# EAGLE design atlas_quad (EAGLE 8.5.0)

## Sheet 1 of 2
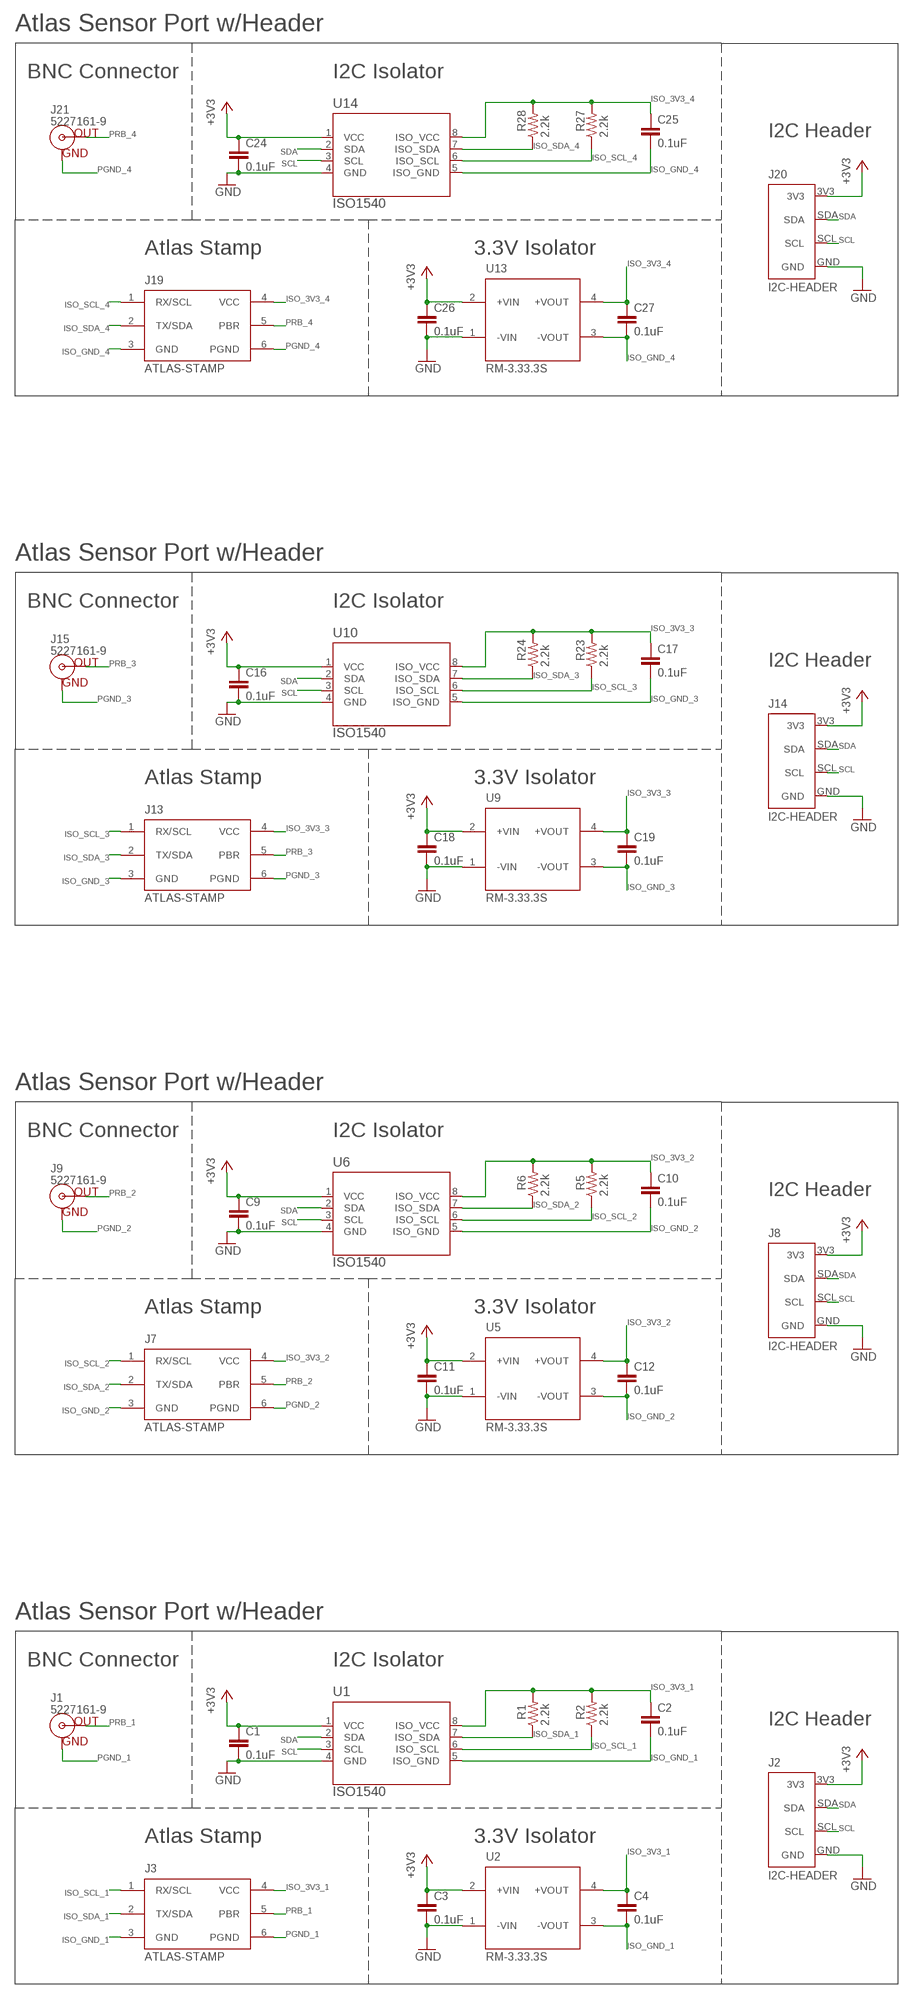
[diagram p0: schematic, sheet 1, part 1 of 3]
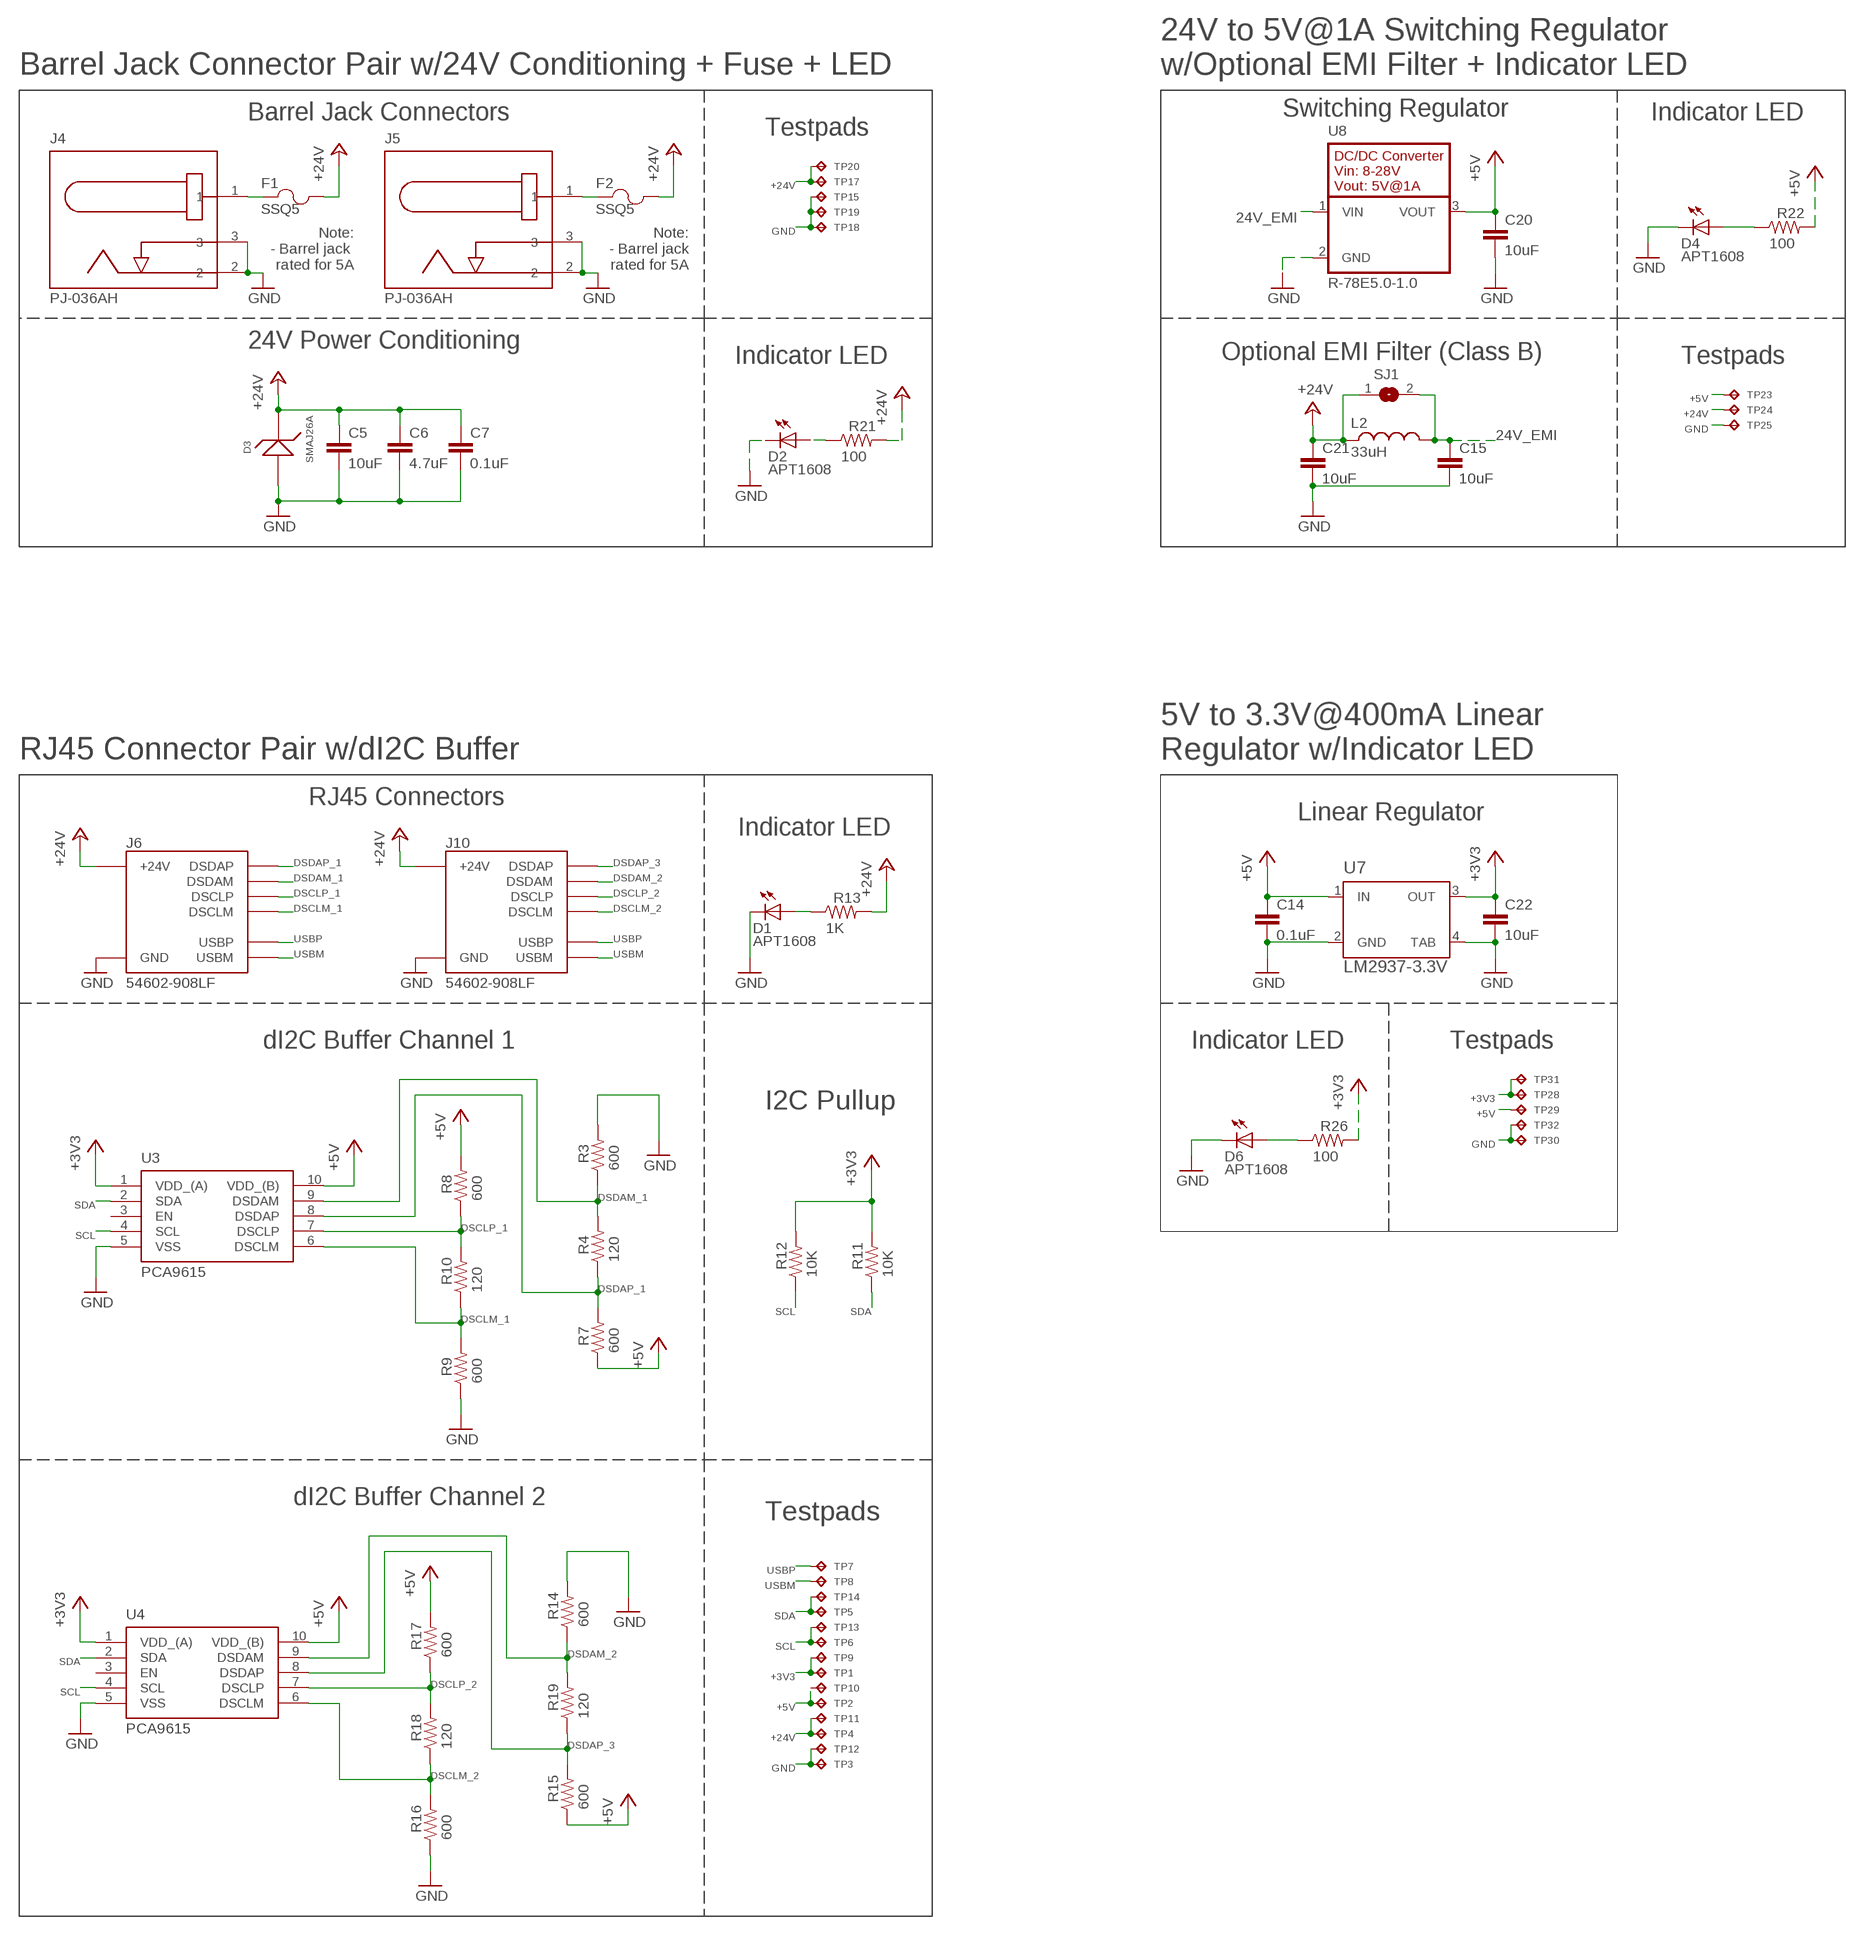
[diagram p1: schematic, sheet 1, part 2 of 3]
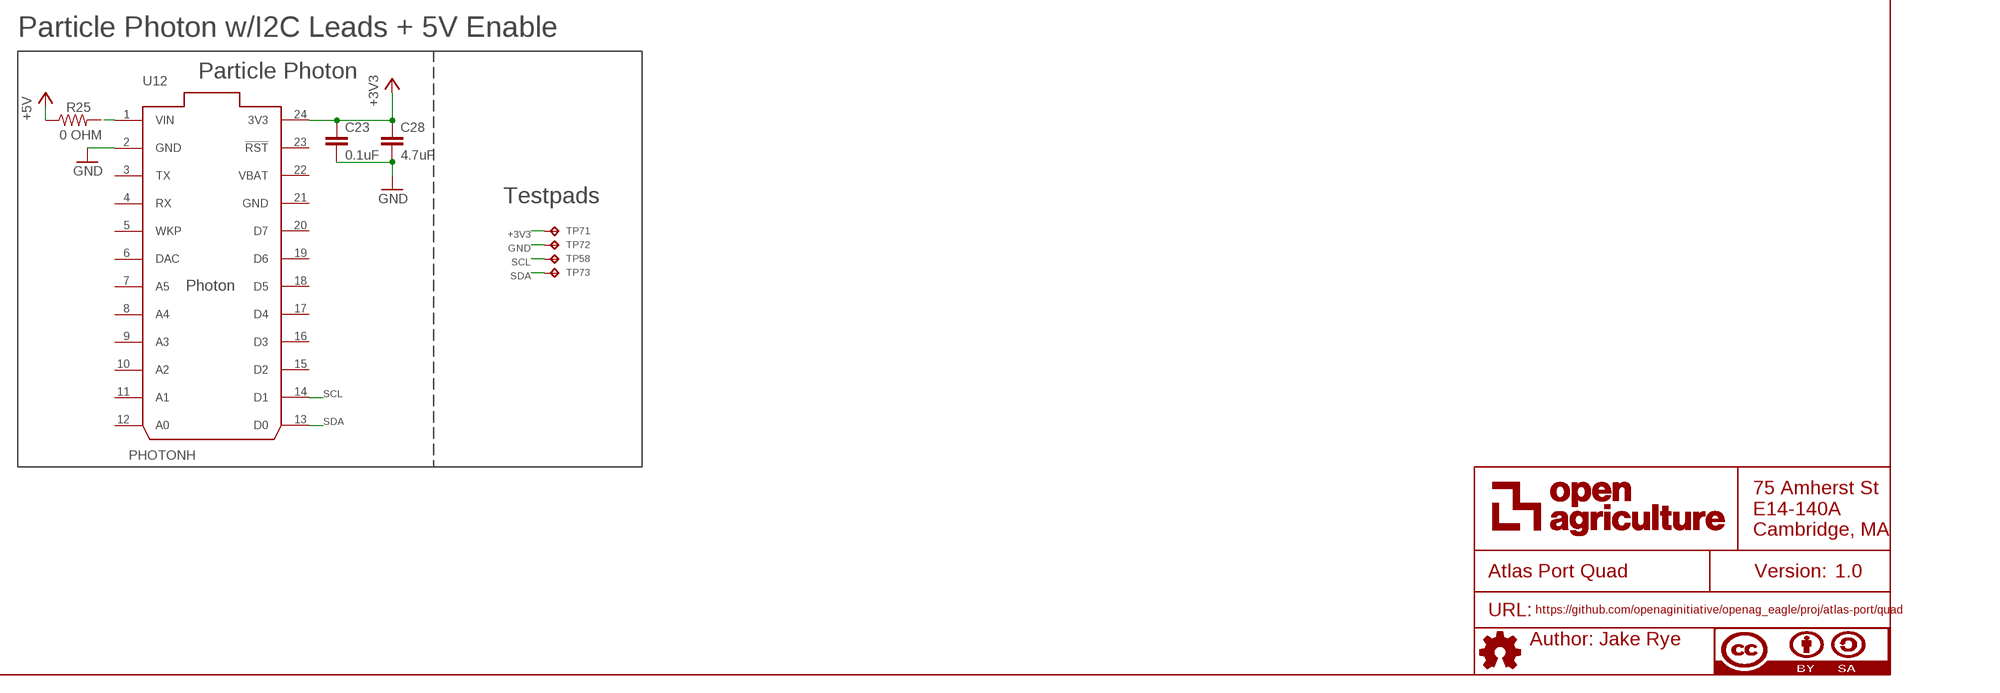
[diagram p2: schematic, sheet 1, part 3 of 3]

### Parts
C1  0.1uF  0.1UF-C0603C104K5RACTU  [C0603]
C2  0.1uF  0.1UF-C0603C104K5RACTU  [C0603]
C3  0.1uF  0.1UF-C0603C104K5RACTU  [C0603]
C4  0.1uF  0.1UF-C0603C104K5RACTU  [C0603]
C5  10uF  10UF-GMK212BBJ106KG-T  [C0805]
C6  4.7uF  4.7UF-CL21A475KBQNNNE  [C0805]
C7  0.1uF  0.1UF-C0603C104K5RACTU  [C0603]
C9  0.1uF  0.1UF-C0603C104K5RACTU  [C0603]
C10  0.1uF  0.1UF-C0603C104K5RACTU  [C0603]
C11  0.1uF  0.1UF-C0603C104K5RACTU  [C0603]
C12  0.1uF  0.1UF-C0603C104K5RACTU  [C0603]
C14  0.1uF  0.1UF-C0603C104K5RACTU  [C0603]
C15  10uF  10UF-GMK212BBJ106KG-T  [C0805]
C16  0.1uF  0.1UF-C0603C104K5RACTU  [C0603]
C17  0.1uF  0.1UF-C0603C104K5RACTU  [C0603]
C18  0.1uF  0.1UF-C0603C104K5RACTU  [C0603]
C19  0.1uF  0.1UF-C0603C104K5RACTU  [C0603]
C20  10uF  10UF-GMK212BBJ106KG-T  [C0805]
C21  10uF  10UF-GMK212BBJ106KG-T  [C0805]
C22  10uF  10UF-GMK212BBJ106KG-T  [C0805]
C23  0.1uF  0.1UF-C0603C104K5RACTU  [C0603]
C24  0.1uF  0.1UF-C0603C104K5RACTU  [C0603]
C25  0.1uF  0.1UF-C0603C104K5RACTU  [C0603]
C26  0.1uF  0.1UF-C0603C104K5RACTU  [C0603]
C27  0.1uF  0.1UF-C0603C104K5RACTU  [C0603]
C28  4.7uF  4.7UF-CL21A475KBQNNNE  [C0805]
D1  APT1608  APT1608CGCK  [CHIPLED_0603]
D2  APT1608  APT1608CGCK  [CHIPLED_0603]
D3  SMAJ26A  SMAJ26A-13-F  [SMA]
D4  APT1608  APT1608CGCK  [CHIPLED_0603]
D6  APT1608  APT1608CGCK  [CHIPLED_0603]
F1  SSQ5  [SS]
F2  SSQ5  [SS]
J1  5227161-9  BNC-5227161-9PTH  [BNC-5227161]
J2  I2C-HEADER  HEADER-I2C  [HEADER-I2C]
J3  ATLAS-STAMP  [ATLAS-STAMP]
J4  PJ-036AH  BARREL-JACK-PJ-036AH-SMT-TR  [BARREL-JACK-PJ-036AH]
J5  PJ-036AH  BARREL-JACK-PJ-036AH-SMT-TR  [BARREL-JACK-PJ-036AH]
J6  54602-908LF  RJ45-DI2C-USB-54602-908LFPTH  [RJ45-DI2C-USB-54602-908LF]
J7  ATLAS-STAMP  [ATLAS-STAMP]
J8  I2C-HEADER  HEADER-I2C  [HEADER-I2C]
J9  5227161-9  BNC-5227161-9PTH  [BNC-5227161]
J10  54602-908LF  RJ45-DI2C-USB-54602-908LFPTH  [RJ45-DI2C-USB-54602-908LF]
J13  ATLAS-STAMP  [ATLAS-STAMP]
J14  I2C-HEADER  HEADER-I2C  [HEADER-I2C]
J15  5227161-9  BNC-5227161-9PTH  [BNC-5227161]
J19  ATLAS-STAMP  [ATLAS-STAMP]
J20  I2C-HEADER  HEADER-I2C  [HEADER-I2C]
J21  5227161-9  BNC-5227161-9PTH  [BNC-5227161]
L2  33uH  33UH-29333C  [29333C]
R1  2.2k  2.2K-RC0603JR-072K2L  [RC0603N]
R2  2.2k  2.2K-RC0603JR-072K2L  [RC0603N]
R3  600  600OHM-RC0603FR-07604RL  [RC0603N]
R4  120  120OHM-RC0603FR-07120RL  [RC0603N]
R5  2.2k  2.2K-RC0603JR-072K2L  [RC0603N]
R6  2.2k  2.2K-RC0603JR-072K2L  [RC0603N]
R7  600  600OHM-RC0603FR-07604RL  [RC0603N]
R8  600  600OHM-RC0603FR-07604RL  [RC0603N]
R9  600  600OHM-RC0603FR-07604RL  [RC0603N]
R10  120  120OHM-RC0603FR-07120RL  [RC0603N]
R11  10K  10K-ERJ-3EKF1002V  [RC0603N]
R12  10K  10K-ERJ-3EKF1002V  [RC0603N]
R13  1K  1K-ERJ-PB3D1001V  [RC0603N]
R14  600  600OHM-RC0603FR-07604RL  [RC0603N]
R15  600  600OHM-RC0603FR-07604RL  [RC0603N]
R16  600  600OHM-RC0603FR-07604RL  [RC0603N]
R17  600  600OHM-RC0603FR-07604RL  [RC0603N]
R18  120  120OHM-RC0603FR-07120RL  [RC0603N]
R19  120  120OHM-RC0603FR-07120RL  [RC0603N]
R21  100  100OHM-RC0603JR-07100RL  [RC0603N]
R22  100  100OHM-RC0603JR-07100RL  [RC0603N]
R23  2.2k  2.2K-RC0603JR-072K2L  [RC0603N]
R24  2.2k  2.2K-RC0603JR-072K2L  [RC0603N]
R25  0 OHM  0OHM-RC0603JR-070RL  [RC0603N]
R26  100  100OHM-RC0603JR-07100RL  [RC0603N]
R27  2.2k  2.2K-RC0603JR-072K2L  [RC0603N]
R28  2.2k  2.2K-RC0603JR-072K2L  [RC0603N]
SJ1  EMI-BYPASS  [EMI-BYPASS]
TP1  TPTP04R  [TP04R]
TP2  TPTP04R  [TP04R]
TP3  TPTP04R  [TP04R]
TP4  TPTP04R  [TP04R]
TP5  TPTP04R  [TP04R]
TP6  TPTP04R  [TP04R]
TP7  TPTP04R  [TP04R]
TP8  TPTP04R  [TP04R]
TP9  TPTP04R  [TP04R]
TP10  TPTP04R  [TP04R]
TP11  TPTP04R  [TP04R]
TP12  TPTP04R  [TP04R]
TP13  TPTP04R  [TP04R]
TP14  TPTP04R  [TP04R]
TP15  TPTP04R  [TP04R]
TP17  TPTP04R  [TP04R]
TP18  TPTP04R  [TP04R]
TP19  TPTP04R  [TP04R]
TP20  TPTP04R  [TP04R]
TP23  TPTP06R  [TP06R]
TP24  TPTP06R  [TP06R]
TP25  TPTP06R  [TP06R]
TP28  TPTP04R  [TP04R]
TP29  TPTP04R  [TP04R]
TP30  TPTP04R  [TP04R]
TP31  TPTP04R  [TP04R]
TP32  TPTP04R  [TP04R]
TP58  TPTP04R  [TP04R]
TP71  TPTP04R  [TP04R]
TP72  TPTP04R  [TP04R]
TP73  TPTP04R  [TP04R]
U1  ISO1540  ISO1540DR  [D8]
U2  RM-3.33.3S  RM3.33.3S  [RM3.33.3S-SIP4]
U3  PCA9615  PCA9615DPJ  [SOP50P490X110-10N]
U4  PCA9615  PCA9615DPJ  [SOP50P490X110-10N]
U5  RM-3.33.3S  RM3.33.3S  [RM3.33.3S-SIP4]
U6  ISO1540  ISO1540DR  [D8]
U7  LM2937-3.3V  LM2937IMP-3.3/NOPB  [MP04A]
U8  R-78E5.0-1.0  [R-78E5.0-1.0]
U9  RM-3.33.3S  RM3.33.3S  [RM3.33.3S-SIP4]
U10  ISO1540  ISO1540DR  [D8]
U12  PHOTONH  PHOTONHPHOTONH  [PHOTON]
U13  RM-3.33.3S  RM3.33.3S  [RM3.33.3S-SIP4]
U14  ISO1540  ISO1540DR  [D8]
U$5  AUTHOR  [AUTHOR]
U$6  TITLE  [TITLE]

### Nets
24V_EMI: C15.1 L2.2 SJ1.2 U8.1(VIN)
24V_IN1: F2.1 J5.1
24V_IN2: F1.1 J4.1
+3V3: C1.1 C3.1 C9.1 C11.1 C16.1 C18.1 C22.1 C23.1 C24.1 C26.1 C28.1 J2.3V3 J8.3V3 J14.3V3 J20.3V3 R11.2 R12.2 R26.2 TP1.1(TP) TP9.1(TP) TP28.1(TP) TP31.1(TP) TP71.1(TP) U1.1(VCC) U2.2(+VIN) U3.1(VDD_(A)) U4.1(VDD_(A)) U5.2(+VIN) U6.1(VCC) U7.3(OUT) U9.2(+VIN) U10.1(VCC) U12.24(3V3) U13.2(+VIN) U14.1(VCC)
+5V: C14.1 C20.1 R7.1 R8.2 R15.1 R17.2 R22.2 R25.1 TP2.1(TP) TP10.1(TP) TP23.TP TP29.1(TP) U3.10(VDD_(B)) U4.10(VDD_(B)) U7.1(IN) U8.3(VOUT)
+24V: C5.1 C6.1 C7.1 C21.1 D3.1 F1.2 F2.2 J6.24V(6)(+24V) J10.24V(6)(+24V) L2.1 R13.2 R21.2 SJ1.1 TP4.1(TP) TP11.1(TP) TP17.1(TP) TP20.1(TP) TP24.TP
DSCLM_1: J6.DSCLM(5)(DSCLM) R9.2 R10.1 U3.6(DSCLM)
DSCLM_2: J10.DSCLM(5)(DSCLM) R16.2 R18.1 U4.6(DSCLM)
DSCLP_1: J6.DSCLP(4)(DSCLP) R8.1 R10.2 U3.7(DSCLP)
DSCLP_2: J10.DSCLP(4)(DSCLP) R17.1 R18.2 U4.7(DSCLP)
DSDAM_1: J6.DSDAM(2)(DSDAM) R3.1 R4.2 U3.9(DSDAM)
DSDAM_2: J10.DSDAM(2)(DSDAM) R14.1 R19.2 U4.9(DSDAM)
DSDAP_1: J6.DSDAP(1)(DSDAP) R4.1 R7.2 U3.8(DSDAP)
DSDAP_3: J10.DSDAP(1)(DSDAP) R15.2 R19.1 U4.8(DSDAP)
GND: C1.2 C3.2 C5.2 C6.2 C7.2 C9.2 C11.2 C14.2 C15.2 C16.2 C18.2 C20.2 C21.2 C22.2 C23.2 C24.2 C26.2 C28.2 D1.C D2.C D3.2 D4.C D6.C J2.GND J4.2 J4.3 J5.2 J5.3 J6.GND(3)(GND) J8.GND J10.GND(3)(GND) J14.GND J20.GND R3.2 R9.1 R14.2 R16.1 TP3.1(TP) TP12.1(TP) TP15.1(TP) TP18.1(TP) TP19.1(TP) TP25.TP TP30.1(TP) TP32.1(TP) TP72.1(TP) U1.4(GND) U2.1(-VIN) U3.5(VSS) U4.5(VSS) U5.1(-VIN) U6.4(GND) U7.2(GND) U7.4(TAB) U8.2(GND) U9.1(-VIN) U10.4(GND) U12.2(GND) U13.1(-VIN) U14.4(GND)
ISO_3V3_1: C2.1 C4.1 J3.4(VCC) R1.2 R2.2 U1.8(ISO_VCC) U2.4(+VOUT)
ISO_3V3_2: C10.1 C12.1 J7.4(VCC) R5.2 R6.2 U5.4(+VOUT) U6.8(ISO_VCC)
ISO_3V3_3: C17.1 C19.1 J13.4(VCC) R23.2 R24.2 U9.4(+VOUT) U10.8(ISO_VCC)
ISO_3V3_4: C25.1 C27.1 J19.4(VCC) R27.2 R28.2 U13.4(+VOUT) U14.8(ISO_VCC)
ISO_GND_1: C2.2 C4.2 J3.3(GND) U1.5(ISO_GND) U2.3(-VOUT)
ISO_GND_2: C10.2 C12.2 J7.3(GND) U5.3(-VOUT) U6.5(ISO_GND)
ISO_GND_3: C17.2 C19.2 J13.3(GND) U9.3(-VOUT) U10.5(ISO_GND)
ISO_GND_4: C25.2 C27.2 J19.3(GND) U13.3(-VOUT) U14.5(ISO_GND)
ISO_SCL_1: J3.1(RX/SCL) R2.1 U1.6(ISO_SCL)
ISO_SCL_2: J7.1(RX/SCL) R5.1 U6.6(ISO_SCL)
ISO_SCL_3: J13.1(RX/SCL) R23.1 U10.6(ISO_SCL)
ISO_SCL_4: J19.1(RX/SCL) R27.1 U14.6(ISO_SCL)
ISO_SDA_1: J3.2(TX/SDA) R1.1 U1.7(ISO_SDA)
ISO_SDA_2: J7.2(TX/SDA) R6.1 U6.7(ISO_SDA)
ISO_SDA_3: J13.2(TX/SDA) R24.1 U10.7(ISO_SDA)
ISO_SDA_4: J19.2(TX/SDA) R28.1 U14.7(ISO_SDA)
N$4: R25.2 U12.1(VIN)
N$5: D1.A R13.1
N$6: D2.A R21.1
N$8: D4.A R22.1
N$11: D6.A R26.1
PGND_1: J1.GND J3.6(PGND)
PGND_2: J7.6(PGND) J9.GND
PGND_3: J13.6(PGND) J15.GND
PGND_4: J19.6(PGND) J21.GND
PRB_1: J1.S(OUT) J3.5(PBR)
PRB_2: J7.5(PBR) J9.S(OUT)
PRB_3: J13.5(PBR) J15.S(OUT)
PRB_4: J19.5(PBR) J21.S(OUT)
SCL: J2.SCL J8.SCL J14.SCL J20.SCL R12.1 TP6.1(TP) TP13.1(TP) TP58.1(TP) U1.3(SCL) U3.4(SCL) U4.4(SCL) U6.3(SCL) U10.3(SCL) U12.14(D1) U14.3(SCL)
SDA: J2.SDA J8.SDA J14.SDA J20.SDA R11.1 TP5.1(TP) TP14.1(TP) TP73.1(TP) U1.2(SDA) U3.2(SDA) U4.2(SDA) U6.2(SDA) U10.2(SDA) U12.13(D0) U14.2(SDA)
USBM: J6.USBM(8)(USBM) J10.USBM(8)(USBM) TP8.1(TP)
USBP: J6.USBP(7)(USBP) J10.USBP(7)(USBP) TP7.1(TP)
Unconnected: U3.3(EN) U4.3(EN) U12.3(TX) U12.4(RX) U12.5(WKP) U12.6(DAC) U12.7(A5) U12.8(A4) U12.9(A3) U12.10(A2) U12.11(A1) U12.12(A0) U12.15(D2) U12.16(D3) U12.17(D4) U12.18(D5) U12.19(D6) U12.20(D7) U12.23(!RST)

### Notes on the sheet
- Atlas Sensor Port w/Header | Barrel Jack Connector Pair w/24V Conditioning + Fuse + LED
- 24V to 5V@1A Switching Regulator
  w/Optional EMI Filter + Indicator LED
- Barrel Jack Connectors | Switching Regulator | Indicator LED
- BNC Connector | I2C Isolator | Testpads
- I2C Header
- Note:
   - Barrel jack 
     rated for 5A
- Note:
   - Barrel jack
     rated for 5A
- 24V Power Conditioning
- Atlas Stamp | 3.3V Isolator | Indicator LED | Optional EMI Filter (Class B) | Testpads
- Atlas Sensor Port w/Header | RJ45 Connector Pair w/dI2C Buffer
- 5V to 3.3V@400mA Linear 
  Regulator w/Indicator LED
- RJ45 Connectors
- BNC Connector | I2C Isolator | Linear Regulator
- Indicator LED
- I2C Header
- Atlas Stamp | 3.3V Isolator | dI2C Buffer Channel 1 | Indicator LED | Testpads
- I2C Pullup
- Atlas Sensor Port w/Header
- BNC Connector | I2C Isolator | dI2C Buffer Channel 2
- Testpads
- I2C Header
- Atlas Stamp | 3.3V Isolator
- Atlas Sensor Port w/Header | Particle Photon w/I2C Leads + 5V Enable
- Particle Photon
- BNC Connector | I2C Isolator
- I2C Header
- Testpads
- Atlas Stamp | 3.3V Isolator

## Sheet 2 of 2

## Power pins joined to a net without a drawn wire
GND: U12.21(GND)
VBAT: U12.22(VBAT)

## Library data of the parts
C1-C4 C7 C9-C12 C14 C16-C19 C23-C27 = openag-capacitors:0.1UF-C0603C104K5RACTU: CAP CER 0.1UF 50V X7R 0603 Description: 0.1µF ±10% 50V Ceramic Capacitor X7R 0603 (1608 Metric) Technical Specifications: Capacitance: 0.1µF Tolerance: ±10% Rated Voltage: 50V Temperature Coefficient: X7R Operating Temperature: -55°C ~ 125°C Package / Case: 0603 (1608 Metric) Datasheet(s): X7R Dielectric, 6.3-250 VDC <https://search.kemet.com/component-edge/download/datasheet/C0603C104K5RACTU.pdf> Vendor(s): Digikey: 399-5089-1-ND <https://www.digikey.com/product-detail/en/kemet/C0603C104K5RACTU/399-5089-1-ND/1465623>; MANUFACTURER: Kemet; MPN: C0603C104K5RACTU; VENDOR: Digikey; VLINK: https://www.digikey.com/product-detail/en/kemet/C0603C104K5RACTU/399-5089-1-ND/1465623; VPN: 399-5089-1-ND
C5 C15 C20-C22 = openag-capacitors:10UF-GMK212BBJ106KG-T: CAP CER 10UF 35V X5R 0805 Description: 10µF ±10% 35V Ceramic Capacitor X5R 0805 (2012 Metric) Technical Specifications: Capacitance: 10µF Tolerance: ±10% Rated Voltage: 35V Temperature Coefficient: X5R Operating Temperature: -55°C ~ 85°C Package / Case: 0805 (2012 Metric) Datasheet(s): GMK212BBJ106KG-T Spec <http://ds.yuden.co.jp/TYCOMPAS/ut/detail.do?productNo=GMK212BBJ106KG-T&fileName=GMK212BBJ106KG-T_SS&mode=specSheetDownload> Vendor(s): Digikey: 587-4893-1-ND <https://www.digikey.com/product-detail/en/taiyo-yuden/GMK212BBJ106KG-T/587-4893-1-ND/6563736>; MANUFACTURER: Taiyo Yuden; MPN: GMK212BBJ106KG-T; VENDOR: Digikey; VLINK: https://www.digikey.com/product-detail/en/taiyo-yuden/GMK212BBJ106KG-T/587-4893-1-ND/6563736; VPN: 587-4893-1-ND
C6 C28 = openag-capacitors:4.7UF-CL21A475KBQNNNE: CAP CER 4.7UF 50V X5R 0805 Description: 4.7µF ±10% 50V Ceramic Capacitor X5R 0805 (2012 Metric) Technical Specifications: Capacitance: 4.7uF Tolerance: ±10% Rated Voltage: 50V Temperature Coefficient: X5R Operating Temperature: -55°C ~ 85°C Package/Case: 0805 (2012 Metric) Datasheet(s): CL21A475KBQNNNE Characteristics <http://www.samsungsem.com/kr/front/downloadcms.do?path=/kr/support/product-search/mlcc/__icsFiles/afieldfile/2014/11/05&fileName=C_CL21A475KBQNNNE.pdf> Vendor(s): Digikey: 1276-1248-1-ND <https://www.digikey.com/product-detail/en/samsung-electro-mechanics/CL21A475KBQNNNE/1276-1248-1-ND/3889334>; MANUFACTURER: Samsung; MPN: CL21A475KBQNNNE; VENDOR: Digikey; VLINK: https://www.digikey.com/product-detail/en/samsung-electro-mechanics/CL21A475KBQNNNE/1276-1248-1-ND/3889334; VPN: 1276-1248-1-ND
D1 D2 D4 D6 = openag-diodes:APT1608CGCK: LED GREEN CLEAR 0603 SMD Description: Green 570nm LED Indication - Discrete 2.1V 0603 (1608 Metric) Technical Specifications: Color: Green Lens Color: Colorless Lens Transparency: Clear Millicandela Rating: 50mcd Lens Style/Size: Rectangle with Flat Top, 1.20mm x 0.80mm Voltage - Forward (Vf) (Typ): 2.1V Current - Test: 20mA Viewing Angle: 120° Mounting Type: Surface Mount Wavelength - Dominant: 570nm Wavelength - Peak: 574nm Package / Case: 0603 (1608 Metric) Supplier Device Package: Chip LED Size / Dimension: 1.60mm L x 0.80mm W Height (Max): 0.75mm Datasheet(s): APT1608CGCK <http://www.kingbrightusa.com/images/catalog/SPEC/APT1608CGCK.pdf> Vendor(s): Digikey: 754-1116-1-ND <https://www.digikey.com/product-detail/en/kingbright/APT1608CGCK/754-1116-1-ND/1747833#>; MANUFACTURER: Kingbright; MPN: APT1608CGCK; VENDOR: Digikey; VLINK: https://www.digikey.com/product-detail/en/kingbright/APT1608CGCK/754-1116-1-ND/1747833#; VPN: 754-1116-1-ND
D3 = openag-diodes:SMAJ26A-13-F: TVS DIODE 26VWM 42.1VC SMA Description: TVS DIODE 26VWM 42.1VC SMA Technical Specifications: Type: Zener Voltage - Reverse Standoff (Typ): 26V Voltage - Breakdown (Min): 28.9V Voltage - Clamping (Max) @ Ipp: 42.1V Current - Peak Pulse (10/1000µs): 9.5A Power - Peak Pulse: 400W Power Line Protection: No Operating Temperature: -55°C ~ 150°C (TJ) DO-214AC, SMA Datasheet(s): SMAJ5.0(C)A - SMAJ200(C)A Vendor(s): Digikey: SMAJ26A-FDICT-ND <https://www.digikey.com/product-detail/en/diodes-incorporated/SMAJ26A-13-F/SMAJ26A-FDICT-ND/806583>; MANUFACTURER: Diodes Incorporated; MPN: SMAJ26A-13-F; VENDOR: Digikey; VLINK: https://www.digikey.com/product-detail/en/diodes-incorporated/SMAJ26A-13-F/SMAJ26A-FDICT-ND/806583; VPN: SMAJ26A-FDICT-ND
F1 F2 = openag-fuses:SSQ5: FUSE BRD MNT 5A 125VAC/VDC 2SMD Description: FUSE BRD MNT 3A 125VAC/VDC 2SMD Technical Specifications: Fuse Type: Board Mount (Cartridge Style Excluded) Current Rating: 5A Voltage Rating - AC: 125V Voltage Rating - DC: 125V Response Time: Fast Package / Case: 2-SMD, Square End Block Mounting Type: Surface Mount Breaking Capacity @ Rated Voltage: 50A AC, 300A DC Melting I²t: 8.8 Approvals: CE, CSA, cULus Operating Temperature: -55°C ~ 125°C Size / Dimension: 0.240" L x 0.100" W x 0.100" H (6.10mm x 2.54mm x 2.54mm) DC Cold Resistance: 0.013 Ohms Datasheet(s): SSQ Type <https://belfuse.com/resources/StewartConnector/SSQ.pdf> Vendor(s): Digikey: 507-1053-1-ND <https://www.digikey.com/product-detail/en/bel-fuse-inc/SSQ-5/507-1053-1-ND/615005>; MANUFACTURER: Bel Fuse Inc.; MPN: SSQ5; VENDOR: Digikey; VLINK: https://www.digikey.com/product-detail/en/bel-fuse-inc/SSQ-5/507-1053-1-ND/615005; VPN: 507-1053-1-ND
J1 J9 J15 J21 = openag-connectors:BNC-5227161-9: CONN BNC JACK R/A 50 OHM PCB Description: BNC Connector Jack, Female Socket 50 Ohm Panel Mount, Through Hole, Right Angle Solder Technical Specifications: Connector Style: BNC Connector Type: Jack, Female Socket Contact Termination: Solder Shield Termination: Solder Impedance: 50 Ohm Mounting Type: Panel Mount, Through Hole, Right Angle Mounting Feature: Bulkhead - Front Side Nut Fastening Type: Bayonet Lock Frequency - Max: 4GHz Number of Ports: 1 Features: Board Guide, Isolated Housing Color: Black, Silver Body Material: Zinc Body Finish: Nickel Center Contact Plating: Gold Dielectric Material: Polymethylpentene (PMP) Operating Temperature: -55°C ~ 85°C Center Contact Material: Phosphor Bronze Voltage Rating: 500V Mating Cycles: 500 Datasheet(s): 5227161 Drawing <http://www.te.com/commerce/DocumentDelivery/DDEController?Action=srchrtrv&DocNm=5227161&DocType=Customer+Drawing&DocLang=English> Vendor(s): Digikey: A32261-ND <https://www.digikey.com/product-detail/en/te-connectivity-amp-connectors/5227161-9/A32261-ND/811159>; MANUFACTURER: TE Connectivity AMP Connectors; MPN: 5227161-9; VENDOR: Digikey; VLINK: https://www.digikey.com/product-detail/en/te-connectivity-amp-connectors/5227161-9/A32261-ND/811159; VPN: A32261-ND
J2 J8 J14 J20 = openag-connectors:HEADER-I2C: 100 MIL HEADER I2C CONNECTIONS; MPN: N/A
J3 J7 J13 J19 = openag-connectors:ATLAS-STAMP; MPN: N/A
J4 J5 = openag-connectors:BARREL-JACK-PJ-036AH-SMT-TR: CONN PWR JACK 2X5.5MM SOLDER Description: Power Barrel Connector Jack 2.10mm ID (0.083"), 5.50mm OD (0.217") Surface Mount, Right Angle Technical Specifications: Connector Type: Jack Gender: Male Industry Recognized Mating Diameter: 2.10mm ID (0.083"), 5.50mm OD (0.217") Actual Diameter: 0.078" (2.00mm ID), 0.248" (6.30mm OD) Number of Positions/Contacts: 2 Conductors, 3 Contacts Internal Switch(s): Single Switch, Normally Closed Mounting Type: Surface Mount, Right Angle Termination: Solder Shielding: Unshielded Voltage - Rated: 24VDC Current Rating: 5A Mating Length/Depth: 0.360" (9.15mm) Contact Material - Plating: Silver Operating Temperature: -25°C ~ 85°C Housing Material: Polyamide (PA6T), Nylon 6T Contact Material: Brass; Copper Alloy Body Color: Black Datasheet(s): PJ-036AH-SMT-TR <http://www.cui.com/product/resource/digikeypdf/pj-036ah-smt-tr.pdf> Vendor(s): Digikey: CP-036AHPJCT-ND <https://www.digikey.com/product-detail/en/cui-inc/PJ-036AH-SMT-TR/CP-036AHPJCT-ND/1530994>; MANUFACTURER: CUI Inc.; MPN: PJ-036AH-SMT-TR; VENDOR: Digikey; VLINK: https://www.digikey.com/product-detail/en/cui-inc/PJ-036AH-SMT-TR/CP-036AHPJCT-ND/1530994; VPN: CP-036AHPJCT-ND
J6 J10 = openag-connectors:RJ45-DI2C-USB-54602-908LF: CONN MOD JACK 8P8C R/A UNSHLD Description: Jack Modular Connector 8p8c (RJ45, Ethernet) 90° Angle (Right) Unshielded Cat3 Technical Specifications: Connector Type: Jack Number of Positions/Contacts: 8p8c (RJ45, Ethernet) Number of Ports: 1 Number of Rows: 1 Mounting Type: Through Hole Orientation: 90° Angle (Right) Termination: Solder Shielding: Unshielded Ratings: Cat3 Features: Board Lock LED Color: Does Not Contain LED Tab Direction: Down Contact Material: Copper Alloy Contact Finish: Gold Contact Finish Thickness: 15µin (0.38µm) Housing Material: Polyester, Glass Filled Operating Temperature: -40°C ~ 70°C Datasheet(s): 54601-x04(zzz)WPLF Drawing <http://cdn.amphenol-icc.com/media/wysiwyg/files/drawing/c-bmj-0102.pdf> Vendor(s): Digikey: 609-1046-ND <https://www.digikey.com/product-detail/en/amphenol-fci/54602-908LF/609-1046-ND/1001360>; MANUFACTURER: Amphenol FCI; MPN: 54602-908LF; VENDOR: Digikey; VLINK: https://www.digikey.com/product-detail/en/amphenol-fci/54602-908LF/609-1046-ND/1001360; VPN: 609-1046-ND
L2 = openag-inductors:33UH-29333C: FIXED IND 33UH 1A 120 MOHM SMD Description: 33µH Shielded Wirewound Inductor 1A 120 mOhm Max Nonstandard Technical Specifications: Type: Wirewound Inductance: 33µH Current Rating: 1A Shielding: Shielded DC Resistance (DCR): 120 mOhm Max Operating Temperature: -40°C ~ 85°C Frequency - Test: 10kHz Mounting Type: Surface Mount Package / Case: Nonstandard Size / Dimension: 0.283" L x 0.283" W (7.20mm x 7.20mm) Height - Seated (Max): 0.157" (4.00mm) Datasheet(s): 2900 Series <https://www.murata-ps.com/data/magnetics/kmp_2900.pdf> Vendor(s): Digikey: 811-1138-1-ND <https://www.digikey.com/product-detail/en/murata-power-solutions-inc/29333C/811-1138-1-ND/1924860>; MANUFACTURER: Murata Power Solutions Inc.; MPN: 29333C; VENDOR: Digikey; VLINK: https://www.digikey.com/product-detail/en/murata-power-solutions-inc/29333C/811-1138-1-ND/1924860; VPN: 811-1138-1-ND
R1 R2 R5 R6 R23 R24 R27 R28 = openag-resistors:2.2K-RC0603JR-072K2L: RES SMD 2.2K OHM 5% 1/10W 0603 Description: 2.2 kOhms ±5% 0.1W, 1/10W Chip Resistor 0603 (1608 Metric) Moisture Resistant Thick Film Technical Specifications: Resistance: 2.2 kOhms Tolerance: ±5% Power (Watts): 0.1W, 1/10W Composition: Thick Film Features: Moisture Resistant Temperature Coefficient: ±100ppm/°C Operating Temperature: -55°C ~ 155°C Package / Case: 0603 (1608 Metric) Supplier Device Package: 0603 Size / Dimension: 0.063" L x 0.032" W (1.60mm x 0.80mm) Height - Seated (Max): 0.022" (0.55mm) Number of Terminations: 2 Datasheet(s): RC Series, L Datasheet <http://www.yageo.com/documents/recent/PYu-RC_Group_51_RoHS_L_8.pdf> Chip Resistor Marking <http://www.yageo.com/exep/pages/download/literatures/PYu-R_Marking_2.pdf> Vendor(s): Digikey: 311-2.2KGRCT-ND <https://www.digikey.com/product-detail/en/yageo/RC0603JR-072K2L/311-2.2KGRCT-ND/729676#>; MANUFACTURER: Yageo; MPN: RC0603JR-072K2L; VENDOR: Digikey; VLINK: https://www.digikey.com/product-detail/en/yageo/RC0603JR-072K2L/311-2.2KGRCT-ND/729676#; VPN: 311-2.2KGRCT-ND
R3 R7-R9 R14-R17 = openag-resistors:600OHM-RC0603FR-07604RL: RES SMD 604 OHM 1% 1/10W 0603 Description: 604 Ohms ±1% 0.1W, 1/10W Chip Resistor 0603 (1608 Metric) Moisture Resistant Thick Film Technical Specifications: Resistance: 604 Ohms Tolerance: ±1% Power (Watts): 0.1W, 1/10W Composition: Thick Film Features: Moisture Resistant Temperature Coefficient: ±100ppm/°C Operating Temperature: -55°C ~ 155°C Package / Case: 0603 (1608 Metric) Supplier Device Package: 0603 Size / Dimension: 0.063" L x 0.032" W (1.60mm x 0.80mm) Height - Seated (Max): 0.022" (0.55mm) Number of Terminations: 2 Datasheet(s): RC Series, L Datasheet <http://www.yageo.com/documents/recent/PYu-RC_Group_51_RoHS_L_8.pdf> Chip Resistor Marking <http://www.yageo.com/exep/pages/download/literatures/PYu-R_Marking_2.pdf> Vendor(s): Digikey: 311-604HRCT-ND <https://www.digikey.com/product-detail/en/yageo/RC0603FR-07604RL/311-604HRCT-ND/730276>; MANUFACTURER: Yageo; MPN: RC0603FR-07604RL; VENDOR: Digikey; VLINK: https://www.digikey.com/product-detail/en/yageo/RC0603FR-07604RL/311-604HRCT-ND/730276; VPN: 311-604HRCT-ND
R4 R10 R18 R19 = openag-resistors:120OHM-RC0603FR-07120RL: RES SMD 120 OHM 1% 1/10W 0603 Description: 120 Ohms ±1% 0.1W, 1/10W Chip Resistor 0603 (1608 Metric) Moisture Resistant Thick Film Technical Specifications: Resistance: 120 Ohms Tolerance: ±1% Power (Watts): 0.1W, 1/10W Composition: Thick Film Features: Moisture Resistant Temperature Coefficient: ±100ppm/°C Operating Temperature: -55°C ~ 155°C Package / Case: 0603 (1608 Metric) Supplier Device Package: 0603 Size / Dimension: 0.063" L x 0.032" W (1.60mm x 0.80mm) Height - Seated (Max): 0.022" (0.55mm) Number of Terminations: 2 Datasheet(s): RC Series, L Datasheet <http://www.yageo.com/documents/recent/PYu-RC_Group_51_RoHS_L_8.pdf> Chip Resistor Marking <http://www.yageo.com/exep/pages/download/literatures/PYu-R_Marking_2.pdf> Vendor(s): Digikey: 311-120HRCT-ND <https://www.digikey.com/product-detail/en/yageo/RC0603FR-07120RL/311-120HRCT-ND/729867>; MANUFACTURER: Yageo; MPN: RC0603FR-07120RL; VENDOR: Digikey; VLINK: https://www.digikey.com/product-detail/en/yageo/RC0603FR-07120RL/311-120HRCT-ND/729867; VPN: 311-120HRCT-ND
R11 R12 = openag-resistors:10K-ERJ-3EKF1002V: RES SMD 10K OHM 1% 1/10W 0603 Description: 10 kOhms ±1% 0.1W, 1/10W Chip Resistor 0603 (1608 Metric) Automotive AEC-Q200 Thick Film Technical Specifications: Resistance: 10kOhms Tolerance: ±1% Power: 0.1W, 1/10W Operating Temperature: -55°C ~ 155°C Package/Case: 0603 (1608 Metric) Datasheet(s): ERJ-3EKF1002V View All Specifications <https://industrial.panasonic.com/ww/products/resistors/chip-resistors/general-purpose-chip-resistors/precision-thick-film-chip-resistors/ERJ3EKF1002V> Vendor(s): Digikey: P10.0KHCT-ND <https://www.digikey.com/product-detail/en/panasonic-electronic-components/ERJ-3EKF1002V/P10.0KHCT-ND/198102>; MANUFACTURER: Panasonic; MPN: ERJ-3EKF1002V; VENDOR: Digikey; VLINK: https://www.digikey.com/product-detail/en/panasonic-electronic-components/ERJ-3EKF1002V/P10.0KHCT-ND/198102; VPN: P10.0KHCT-ND
R13 = openag-resistors:1K-ERJ-PB3D1001V: RES SMD 1K OHM 0.5% 1/5W 0603 Description: 1 kOhms ±0.5% 0.2W, 1/5W Chip Resistor 0603 (1608 Metric) Automotive AEC-Q200, Pulse Withstanding Thick Film Technical Specifications: Resistance: 1 kOhms Tolerance: ±0.5% Power: 0.2W, 1/5W Operating Temperature: -55°C ~ 155°C Package / Case: 0603 (1608 Metric) Datasheet(s): ERJ-PB3, PB6 Series, High Precision Datasheet <https://industrial.panasonic.com/cdbs/www-data/pdf/RDM0000/AOA0000C328.pdf> Vendor(s): Digikey: P20283CT-ND <https://www.digikey.com/product-detail/en/panasonic-electronic-components/ERJ-PB3D1001V/P20283CT-ND/6214538>; MANUFACTURER: Panasonic; MPN: P20283CT-ND; VENDOR: Digikey; VLINK: https://www.digikey.com/product-detail/en/panasonic-electronic-components/ERJ-PB3D1001V/P20283CT-ND/6214538; VPN: P20283CT-ND
R21 R22 R26 = openag-resistors:100OHM-RC0603JR-07100RL: RES SMD 100 OHM 5% 1/10W 0603 Description: 100 Ohms ±5% 0.1W, 1/10W Chip Resistor 0603 (1608 Metric) Moisture Resistant Thick Film Technical Specifications: Resistance: 100 Ohms Tolerance: ±5% Power (Watts): 0.1W, 1/10W Composition: Thick Film Features: Moisture Resistant Temperature Coefficient: ±100ppm/°C Operating Temperature: -55°C ~ 155°C Package / Case: 0603 (1608 Metric) Supplier Device Package: 0603 Size / Dimension: 0.063" L x 0.032" W (1.60mm x 0.80mm) Height - Seated (Max): 0.022" (0.55mm) Number of Terminations: 2 Datasheet(s): Thick Film Chip Resistor Intro <http://www.yageo.com.tw/exep/pages/download/literatures/PYu-R_INT-thick_7.pdf> Chip Resistor Marking <http://www.yageo.com/exep/pages/download/literatures/PYu-R_Marking_2.pdf> RC Series, L Datasheet <http://www.yageo.com/documents/recent/PYu-RC_Group_51_RoHS_L_8.pdf> Vendor(s): Digikey: 311-100GRCT-ND <https://www.digikey.com/product-detail/en/yageo/RC0603JR-07100RL/311-100GRCT-ND/729644>; MANUFACTURER: Yageo; MPN: RC0603JR-07100RL; VENDOR: Digikey; VLINK: https://www.digikey.com/product-detail/en/yageo/RC0603JR-07100RL/311-100GRCT-ND/729644; VPN: 311-100GRCT-ND
R25 = openag-resistors:0OHM-RC0603JR-070RL: RES SMD 0 OHM JUMPER 1/10W 0603 Description: 0 Ohms Jumper 0.1W, 1/10W Chip Resistor 0603 (1608 Metric) Moisture Resistant Thick Film Technical Specifications: Resistance: 0 Ohms Power: 0.1W, 1/10W Operating Temperature: -55°C ~ 155°C Package / Case: 0603 (1608 Metric) Datasheet(s): RC Series, L Datasheet <http://www.yageo.com/documents/recent/PYu-RC_Group_51_RoHS_L_8.pdf> Vendor(s): Digikey: 311-0.0GRCT-ND <https://www.digikey.com/product-detail/en/yageo/RC0603JR-070RL/311-0.0GRCT-ND/729622>; MANUFACTURER: Yageo; MPN: RC0603JR-070RL; VENDOR: Digikey; VLINK: https://www.digikey.com/product-detail/en/yageo/RC0603JR-070RL/311-0.0GRCT-ND/729622; VPN: 311-0.0GRCT-ND
SJ1 = openag-connectors:EMI-BYPASS: EMI Bypass Solder Jumper; MPN: N/A
TP1-TP15 TP17-TP20 TP23-TP25 TP28-TP32 TP58 TP71-TP73 = openag-testpads:TP: Test pad; MPN: N/A
U1 U6 U10 U14 = openag-isolators:ISO1540DR: DGTL ISO 2.5KV 2CH I2C 8SOIC Description: I²C Digital Isolator 2500Vrms 2 Channel 1Mbps 25kV/µs CMTI 8-SOIC (0.154", 3.90mm Width) Technical Specifications: Technology: Capacitive Coupling Type: I²C Number of Channels: 2 Channel Type: Bidirectional Voltage-Isolation: 2500Vrms Voltage - Supply: 3 V ~ 5.5 V Data Rate: 1Mbps Operating Temperature: -40°C ~ 125°C Package / Case: 8-SOIC (0.154", 3.90mm Width) Max Supply Current (3V ≤ VCC1, VCC2 ≤ 3.6V) Side 1, Side 2: 3.8mA, 3.1mA Datasheet(s): ISO154x <http://www.ti.com/lit/ds/symlink/iso1540.pdf> Vendor(s): Digikey: 296-34871-1-ND <https://www.digikey.com/product-detail/en/texas-instruments/ISO1540DR/296-34871-1-ND/3587214>; MANUFACTURER: Texas Instruments; MPN: ISO1540DR; VENDOR: Digikey; VLINK: https://www.digikey.com/product-detail/en/texas-instruments/ISO1540DR/296-34871-1-ND/3587214; VPN: 296-34871-1-ND
U2 U5 U9 U13 = openag-isolators:RM3.33.3S: CONV DC/DC 0.25W SGL 3.3VOUT SIP Description: Isolated Module DC DC Converter 1 Output 3.3V 76mA 3V - 3.6V Input Technical Specifications: Type: Isolated Module Number of Outputs: 1 Voltage - Input (Min): 3V Voltage - Input (Max): 3.6V Voltage - Output 1: 3.3V Current - Output (Max): 76mA Power (Watts): 250mW Voltage - Isolation: 1kV Applications: ITE (Commercial) Features: SCP Operating Temperature: -40°C ~ 85°C Efficiency: 70% Mounting Type: Through Hole Package / Case: 4-SIP Module Size / Dimension: 0.45" L x 0.24" W x 0.39" H (11.5mm x 6.0mm x 10.0mm) Datasheet(s): RM Series Datasheet <https://www.recom-power.com/pdf/Econoline/RM.pdf> Vendor(s): Digikey: 945-1212-ND <https://www.digikey.com/product-detail/en/recom-power/RM-3.33.3S/945-1212-ND/2256392>; MANUFACTURER: Recom Power; MPN: RM-3.33.3S; VENDOR: Digikey; VLINK: https://www.digikey.com/product-detail/en/recom-power/RM-3.33.3S/945-1212-ND/2256392; VPN: 945-1212-ND
U3 U4 = openag-buffers:PCA9615DPJ: IC REDRIVER I2C 2CH 10TSSOP Description: Buffer, ReDriver 2 Channel 400kHz 10-TSSOP Technical Specifications: Type: Buffer, ReDriver Applications: I²C Input: 2-Wire Bus Output: 2-Wire Bus Data Rate (Max): 400kHz Number of Channels: 2 Capacitance - Input: 7pF Voltage - Supply: 2.3 V ~ 5.5 V Current - Supply: 16µA Operating Temperature: -40°C ~ 85°C Package / Case: 10-TFSOP, 10-MSOP (0.118", 3.00mm Width) Supplier Device Package: 10-TSSOP Base Part Number: PCA9615 Datasheet(s): PCA9615DP <http://www.nxp.com/documents/data_sheet/PCA9615.pdf> Vendor(s): Digikey: 568-11484-1-ND <https://www.digikey.com/product-detail/en/nxp-usa-inc/PCA9615DPJ/568-11484-1-ND/4864508>; MANUFACTURER: NXP USA Inc.; MPN: PCA9615DPJ; VENDOR: Digikey; VLINK: https://www.digikey.com/product-detail/en/nxp-usa-inc/PCA9615DPJ/568-11484-1-ND/4864508; VPN: 568-11484-1-ND
U7 = openag-regulators:LM2937IMP-3.3/NOPB: IC REG LIN 3.3V 400MA SOT223-4 Description: Linear Voltage Regulator IC Positive Fixed 1 Output 3.3V 400mA SOT-223-4 Technical Specifications: Output Configuration: Positive Output Type: Fixed Number of Regulators: 1 Voltage - Input (Max): 26V Voltage - Output (Min/Fixed): 3.3V Voltage Dropout (Max): 1V @ 50mA Current - Output: 400mA Current - Quiescent (Iq): 2mA Current - Supply (Max): 1.25A Protection Features: Over Temperature, Reverse Polarity, Short Circuit Operating Temperature: -40°C ~ 85°C Mounting Type: Surface Mount Package / Case: TO-261-4, TO-261AA Supplier Device Package: SOT-223-4 Base Part Number: LM2937 Datasheet(s): LM2937-2.5, LM2937-3.3 Datasheet <http://www.ti.com/lit/ds/symlink/lm2937-2.5.pdf> Vendor(s): Digikey: LM2937IMP-3.3/NOPBCT-ND <https://www.digikey.com/product-detail/en/texas-instruments/LM2937IMP-3.3-NOPB/LM2937IMP-3.3-NOPBCT-ND/270742#>; MANUFACTURER: Texas Instruments; MPN: LM2937IMP-3.3/NOPB; VENDOR: Digikey; VLINK: https://www.digikey.com/product-detail/en/texas-instruments/LM2937IMP-3.3-NOPB/LM2937IMP-3.3-NOPBCT-ND/270742#; VPN: LM2937IMP-3.3/NOPBCT-ND
U8 = openag-regulators:R-78E5.0-1.0: DC/DC CONVERTER 5V 5W Description: Linear Regulator Replacement DC DC Converter 1 Output 5V 1A 8V - 28V Input Technical Specifications: Type: Linear Regulator Replacement Number of Outputs: 1 Voltage - Input (Min): 8V Voltage - Input (Max): 28V Voltage - Output 1: 5V Current - Output (Max): 1A Power (Watts): 5W Applications: ITE (Commercial) Features: SCP Operating Temperature: -40°C ~ 85°C Efficiency: 91% Mounting Type: Through Hole Package / Case: 3-SIP Module Size / Dimension: 0.46" L x 0.33" W x 0.41" H (11.6mm x 8.5mm x 10.4mm) Datasheet(s): R-78E-1.0 Series Datasheet <https://www.recom-power.com/pdf/Innoline/R-78Exx-1.0.pdf> Vendor(s): Digikey: 945-2201-ND <https://www.digikey.com/product-detail/en/recom-power/R-78E5.0-1.0/945-2201-ND/4930585>; MANUFACTURER: Recom Power; MPN: R-78E5.0-1.0; VENDOR: Digikey; VLINK: https://www.digikey.com/product-detail/en/recom-power/R-78E5.0-1.0/945-2201-ND/4930585; VPN: 945-2201-ND
U12 = openag-microcontrollers:PHOTONH: Tiny Wi-Fi dev board w/cloud backend Description: The Photon is a $19 tiny Wi-Fi development kit for creating connected projects and products for the Internet of Things. It's easy to use, it's powerful, and it's connected to the cloud. Technical Specifications: Processor: STM32F205RGY6 120Mhz ARM Cortex M3 Wireless: 802.11b/g/n Wi-Fi Peripherals: Digital(x18), ADC(x8), DAC(x2), SPI(x2), I2S(x1), I2C(x1) SPI, CAN(1), USB(1), PWM(9) Memory: 1MB flash, 128KB RAM Cerfifications: FCC, CE and IC Operating Temperature: -20°C ~ 60°C Humidity Range: Non condensing, relative humidity: 95% Supply Input Voltage (VIN): 3.6V ~ 5.5V Supply Input Voltage (3V3): 3.0V ~ 3.6V Max Supply Output Current (VIN): 1A Max Supply Output Current (3V3): 100mA Average Operating Current (WiFi on, @VIN): up to 100mA Peak Operating Current (WiFi on, @VIN): up to 430mA I/O Max Source/Sink Current (Individual): 25mA I/O Max Source/Sinnk Current (Total): 120mA Datasheet(s): Photon Datasheet <https://docs.particle.io/datasheets/photon-datasheet/> Vendor(s): Particle: PHOTONH <https://store.particle.io/products/photon>; MANUFACTURER: Particle; MPN: PHOTONH; VENDOR: Particle; VLINK: https://store.particle.io/products/photon; VPN: PHOTONH
U$5 = openag-frames:AUTHOR; AUTHOR: Jake Rye; MPN: N/A
U$6 = openag-frames:TITLE; MPN: N/A; TITLE: Atlas Port Quad; URL: https://github.com/openaginitiative/openag_eagle/proj/atlas-port/quad; VER: 1.0

## Board
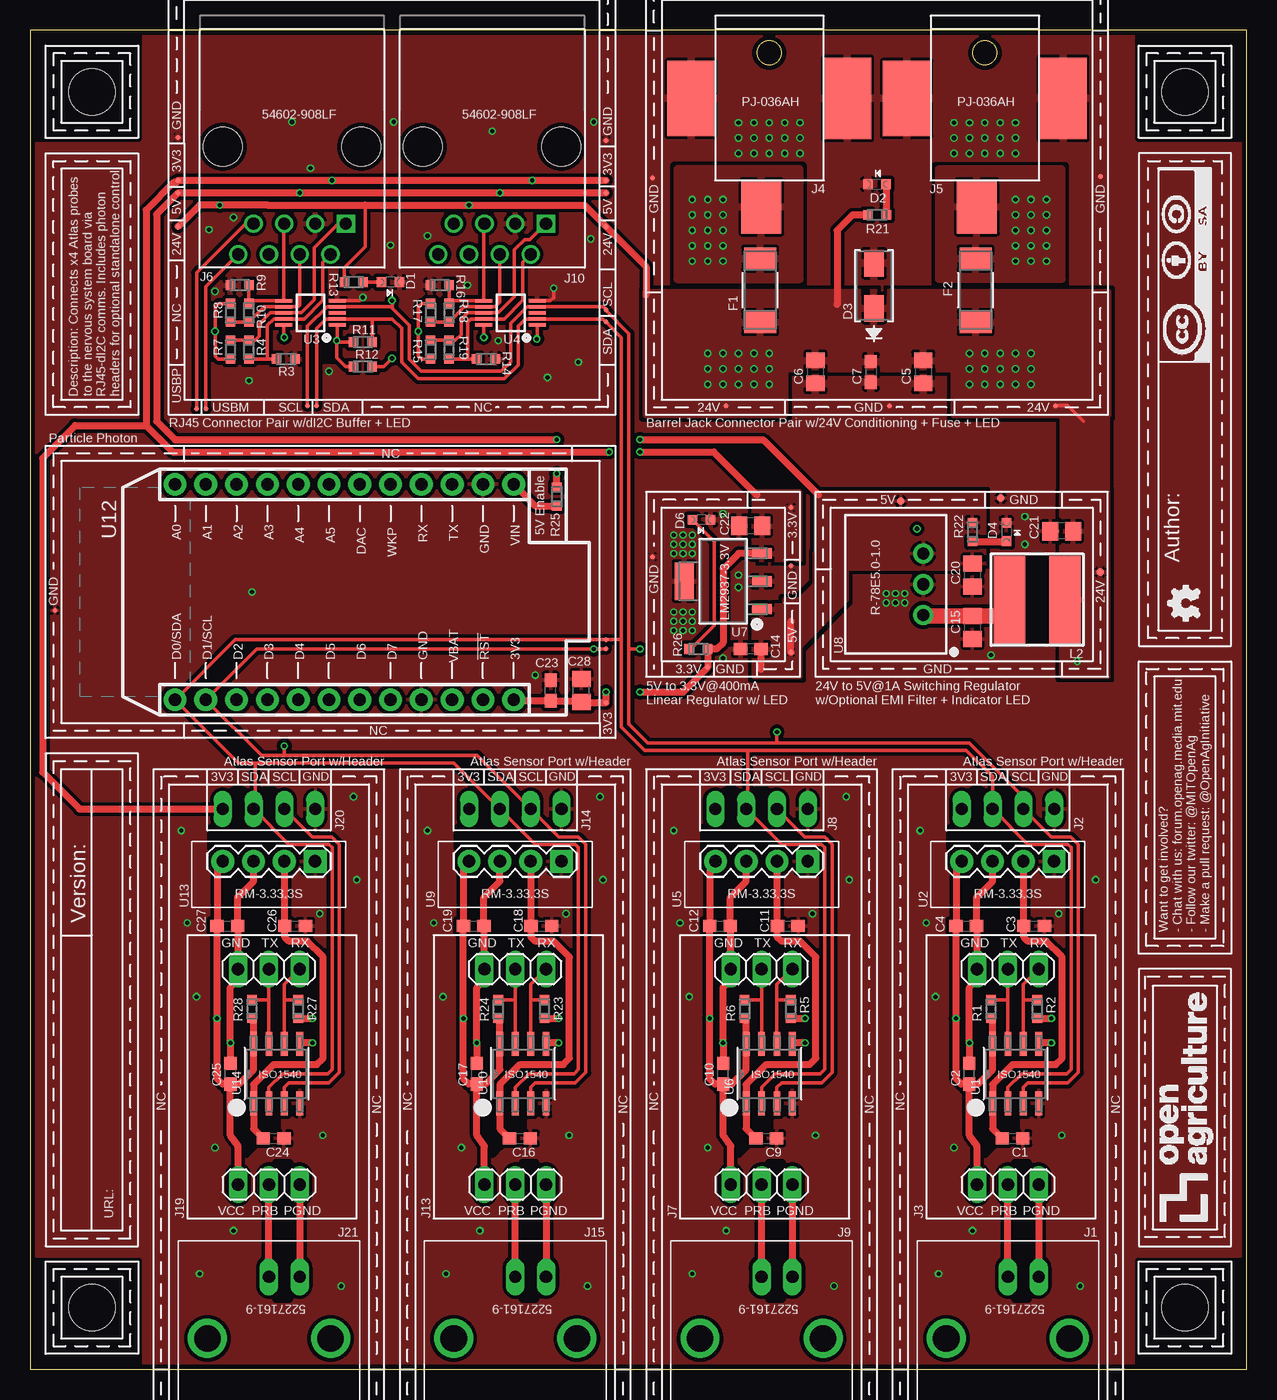
[diagram p3: board, top side]
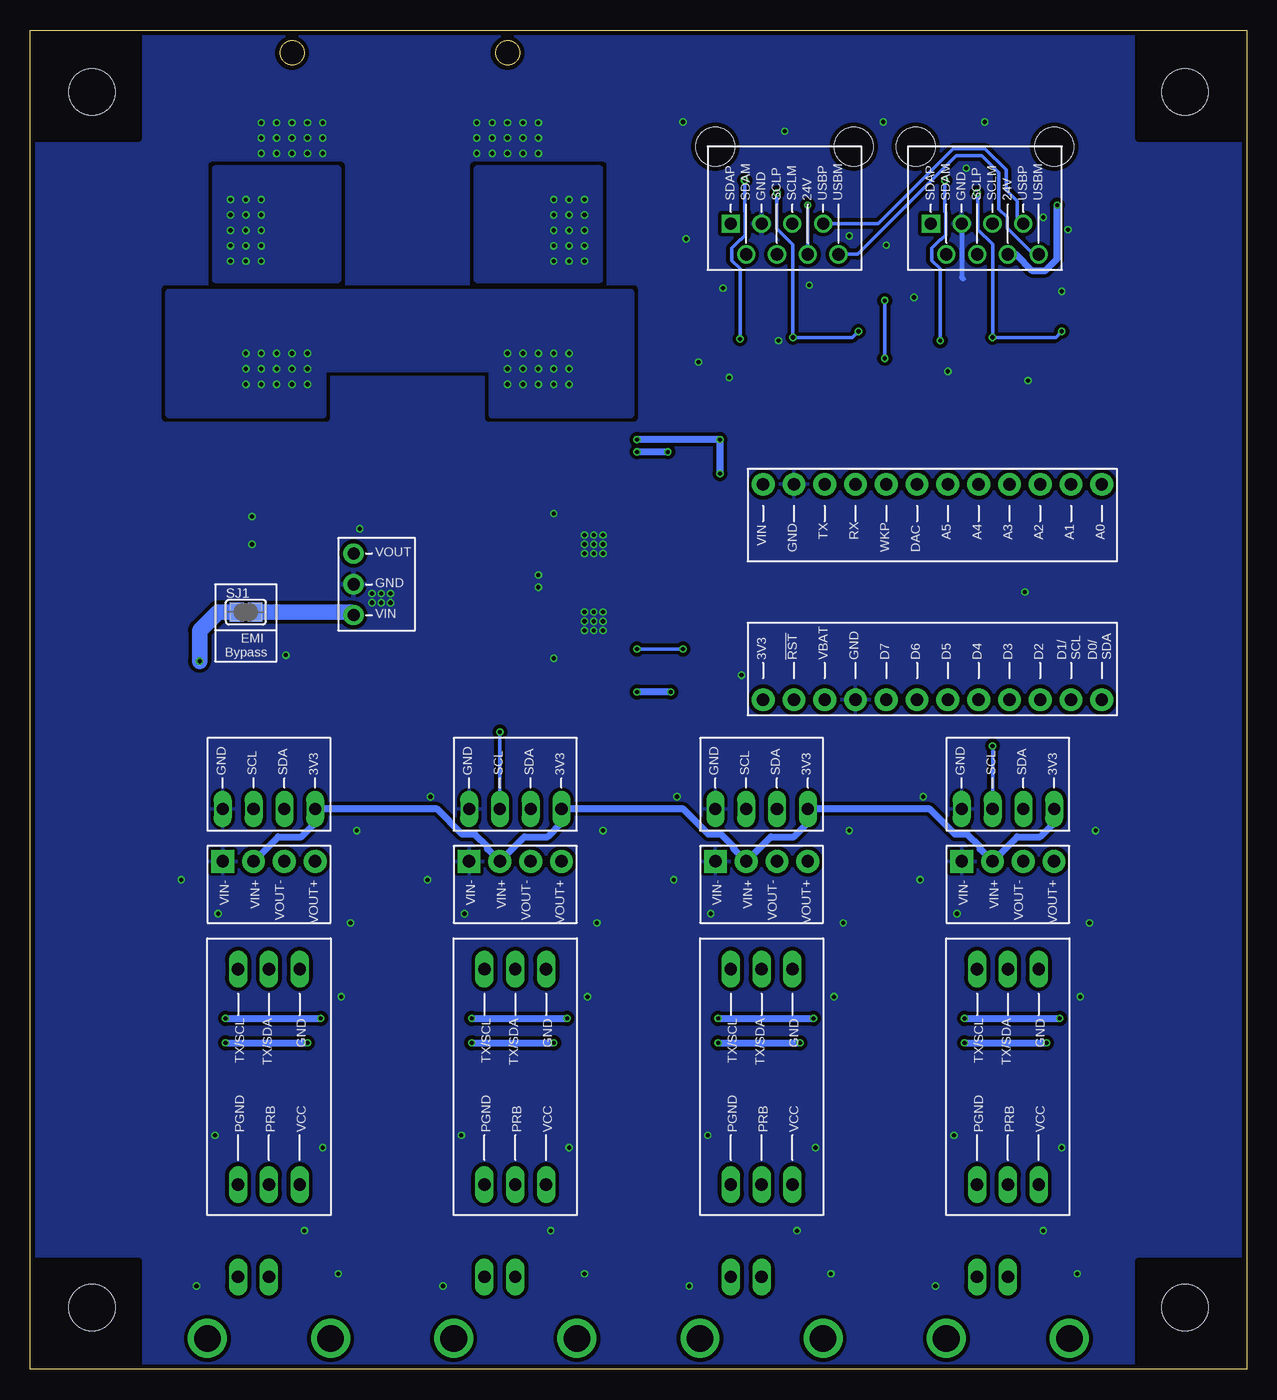
[diagram p4: board, bottom side, seen from below]

Size 100.33 x 110.49 mm. Coordinates in mm from the lower left corner, seen from the top.
Outline: 100.33,0 100.33,110.49 0,110.49 0,0 100.33,0
Copper layers (1*16): Top 0.035559375mm / dielectric 1.6mm / Bottom 0.035559375mm
Design rules "openag-router": minimum track width 6mil, minimum drill 10mil, track to track 12mil, track to pad 12mil, pad to pad 12mil, via to via 12mil, smd to smd 12mil, copper to edge 15mil, drill to drill 6mil, minimum pad ring 5mil, minimum via ring 5mil, stop-mask expansion 2.5mil, vias tented up to drill 20mil, thermal gap 10mil
tRestrict: 28 lines

### Footprints (pad centres in the part's own frame; a part is rotated, then mirrored left to right if it is on the bottom)
C0603 = smd 1.1 x 1: 1 -0.85,0; 2 0.85,0
C0805 = smd 1.3 x 1.5: 1 -0.95,0; 2 0.95,0
CHIPLED_0603 = smd 0.8 x 0.8: A 0,-0.75; C 0,0.75
SMA = smd 2.18 x 1.63: 1 -1.857,0; 2 1.857,0
SS = smd 1.803 x 2.642: 1 -2.629,0; 2 2.629,0
BNC-5227161 = drill 2.2: 3 -5.08,0; 4 5.08,0 | drill 1.016 long: GND -2.54,-5.08; S 0,-5.08
HEADER-I2C = drill 1 long: 3V3 3.81,0.762; GND -3.81,0.762; SCL -1.27,0.762; SDA 1.27,0.762
ATLAS-STAMP = drill 1.016 long: 1 -8.89,2.54; 2 -8.89,0; 3 -8.89,-2.54; 4 8.89,-2.54; 5 8.89,0; 6 8.89,2.54
BARREL-JACK-PJ-036AH = smd 4.4 x 3.3: 1 2.2,-0.65 | smd 6.75 x 3.9: 2 -6.75,6.45 | smd 6.2 x 3.9: 3 -6.75,-6.45
RJ45-DI2C-USB-54602-908LF = drill 1: 24V(6) 1.905,8.89; DSCLM(5) 0.635,6.35; DSCLP(4) -0.635,8.89; DSDAM(2) -3.175,8.89; GND(3) -1.905,6.35; USBM(8) 4.445,8.89; USBP(7) 3.175,6.35 | drill 1 square: DSDAP(1) -4.445,6.35 | hole 3.2: -5.715,0; 5.715,0
29333C = smd 2.6 x 7.2: 1 -2.3,0; 2 2.3,0
RC0603N = smd 0.756 x 0.8: 1 -0.778,0; 2 0.778,0
EMI-BYPASS = smd 1.168 x 1.6: 1 -0.762,0.254; 2 0.762,0.254
TP04R = smd 0.4 x 0.4: 1 0,0
TP06R = smd 0.6 x 0.6: TP 0,0
D8 = smd 1.981 x 0.559: 1 -2.464,1.905; 2 -2.464,0.635; 3 -2.464,-0.635; 4 -2.464,-1.905; 5 2.464,-1.905; 6 2.464,-0.635; 7 2.464,0.635; 8 2.464,1.905
RM3.33.3S-SIP4 = drill 1.016 pad 1.88 square: 1 0,0 | drill 1.016 pad 1.88: 2 2.54,0; 3 5.08,0; 4 7.62,0
SOP50P490X110-10N = smd 1.4 x 0.3: 1 -2.2,1; 2 -2.2,0.5; 3 -2.2,0; 4 -2.2,-0.5; 5 -2.2,-1; 6 2.2,-1; 7 2.2,-0.5; 8 2.2,0; 9 2.2,0.5; 10 2.2,1
MP04A = smd 1.6 x 0.838: 1 -3.2,2.3; 2 -3.2,0; 3 -3.2,-2.3 | smd 1.6 x 3.099: 4 3.2,0
R-78E5.0-1.0 = drill 1 pad 1.676: 1 -2.54,0; 2 0,0; 3 2.54,0
PHOTON = drill 1.016 pad 1.88: 1 1.27,32.258; 2 1.27,29.718; 3 1.27,27.178; 4 1.27,24.638; 5 1.27,22.098; 6 1.27,19.558; 7 1.27,17.018; 8 1.27,14.478; 9 1.27,11.938; 10 1.27,9.398; 11 1.27,6.858; 12 1.27,4.318; 13 19.05,4.318; 14 19.05,6.858; 15 19.05,9.398; 16 19.05,11.938; 17 19.05,14.478; 18 19.05,17.018; 19 19.05,19.558; 20 19.05,22.098; 21 19.05,24.638; 22 19.05,27.178; 23 19.05,29.718; 24 19.05,32.258
CORNER-150 = hole 3.81: 0,0

### Placement (x,y rotation side)
C1  81.03,19.05 0 top
C2  77.47,24.38 90 top
C3  82.8,36.58 0 top
C4  77.22,36.58 0 top
C5  73.66,82.3 270 top
C6  64.77,82.3 270 top
C7  69.34,82.3 270 top
C9  60.71,19.05 0 top
C10  57.15,24.38 90 top
C11  62.48,36.58 0 top
C12  56.9,36.58 0 top
C14  59.44,59.44 180 top
C15  77.72,61.21 270 top
C16  40.39,19.05 0 top
C17  36.83,24.38 90 top
C18  42.16,36.58 0 top
C19  36.58,36.58 0 top
C20  77.72,65.53 270 top
C21  85.09,69.15 180 top
C22  59.44,69.6 180 top
C23  42.93,56.01 90 top
C24  20.07,19.05 0 top
C25  16.51,24.38 90 top
C26  21.84,36.58 0 top
C27  16.26,36.58 0 top
C28  45.47,56.01 90 top
D1  29.72,89.71 270 top
D2  69.85,97.79 90 top
D3  69.6,89.41 90 top
D4  80.52,69.09 0 top
D6  55.37,70.1 270 top
F1  60.2,89.03 270 top
F2  77.98,89.03 270 top
J1  80.64,2.54 180 top
J2  80.64,46.99 180 top
J3  80.64,24.13 270 top
J4  60.96,98.12 270 top
J5  78.74,98.12 270 top
J6  21.59,100.89 180 top
J7  60.33,24.13 270 top
J8  60.33,46.99 180 top
J9  60.33,2.54 180 top
J10  38.1,100.89 180 top
J13  40.01,24.13 270 top
J14  40.01,46.99 180 top
J15  40.01,2.54 180 top
J19  19.68,24.13 270 top
J20  19.68,46.99 180 top
J21  19.68,2.54 180 top
L2  83.06,63.5 180 top
R1  79.25,29.72 270 top
R2  83.06,29.72 270 top
R3  21.08,83.36 0 top
R4  18.03,84.12 270 top
R5  62.74,29.72 270 top
R6  58.93,29.72 270 top
R7  16.51,84.12 90 top
R8  16.51,87.17 90 top
R9  17.27,89.46 0 top
R10  18.03,87.17 270 top
R11  27.43,84.76 180 top
R12  27.43,82.73 180 top
R13  26.67,89.71 180 top
R14  37.59,83.36 0 top
R15  33.02,84.12 90 top
R16  33.78,89.46 0 top
R17  33.02,87.17 90 top
R18  34.54,87.17 270 top
R19  34.54,84.12 270 top
R21  69.85,95.25 180 top
R22  77.72,69.09 90 top
R23  42.42,29.72 270 top
R24  38.61,29.72 270 top
R25  43.43,72.01 270 top
R26  55.12,59.44 0 top
R27  22.1,29.72 270 top
R28  18.29,29.72 270 top
SJ1  82.55,62.23 0 bottom
TP1  12.19,98.09 270 top
TP2  12.19,97.08 270 top
TP3  12.19,101.65 270 top
TP4  12.19,94.28 270 top
TP5  23.62,79.5 270 top
TP6  22.86,79.5 270 top
TP7  13.72,79.25 270 top
TP8  14.48,79.25 270 top
TP9  47.5,98.09 270 top
TP10  47.5,97.08 270 top
TP11  47.5,94.28 270 top
TP12  47.5,101.4 270 top
TP13  47.5,87.43 270 top
TP14  47.5,86.41 270 top
TP15  51.31,98.3 0 top
TP17  84.58,79.5 0 top
TP18  70.87,79.5 0 top
TP19  88.27,98.42 0 top
TP20  57.4,79.5 0 top
TP23  71.82,71.63 90 top
TP24  88.27,65.79 90 top
TP25  80.07,71.88 90 top
TP28  55.88,57.91 90 top
TP29  62.74,59.18 90 top
TP30  51.31,67.06 90 top
TP31  62.74,71.12 90 top
TP32  62.74,66.29 90 top
TP58  47.5,59.44 180 top
TP71  47.5,54.99 180 top
TP72  2.03,62.61 180 top
TP73  47.5,60.2 180 top
U1  81.28,24.38 90 top
U2  84.45,41.91 180 top
U3  23.11,87.17 180 top
U4  39.62,87.17 180 top
U5  64.14,41.91 180 top
U6  60.96,24.38 90 top
U7  57.15,65.02 180 top
U8  73.66,64.77 90 top
U9  43.81,41.91 180 top
U10  40.64,24.38 90 top
U12  7.62,74.3 270 top
U13  23.5,41.91 180 top
U14  20.32,24.38 90 top
U$1  [CORNER-150]  95.25,5.08 90 top
U$2  [CORNER-150]  95.25,105.41 180 top
U$3  [CORNER-150]  5.08,5.08 0 top
U$4  [CORNER-150]  5.08,105.41 270 top
U$5  99.06,59.69 90 top
U$6  8.89,10.16 90 top
U$8  [LOGO-900X300]  99.06,10.16 90 top

### Tracks (layer width: path | path; a pad name or v marks a point on that pad's centre or on a via)
24V_EMI
  Top 1.27: U8.1 73.73,62.16 C15.1 79.42,62.16 arc90 L2.2
  Bottom 1.27: SJ1.2 73.91,62.48 U8.1
24V_IN1  (via drill 0.35)
  other vias: 81.28,96.52 82.55,96.52 83.82,96.52 81.28,95.25 81.28,93.98 81.28,92.71 81.28,91.44 82.55,91.44 82.55,92.71 82.55,93.98 82.55,95.25 83.82,95.25 83.82,93.98 83.82,92.71 83.82,91.44
  pour Top (isolate 0.406): 85.09,89.92 74.93,89.92 74.93,99.06 85.09,99.06
  pour Bottom (isolate 0.406): 74.93,89.92 74.93,99.06 85.09,99.06 85.09,89.92
24V_IN2  (via drill 0.35)
  other vias: 54.61,96.52 55.88,96.52 57.15,96.52 54.61,95.25 54.61,93.98 54.61,92.71 54.61,91.44 57.15,91.44 57.15,92.71 57.15,93.98 57.15,95.25 55.88,95.25 55.88,93.98 55.88,92.71 55.88,91.44
  pour Top (isolate 0.406): 53.34,99.06 53.34,89.92 63.5,89.92 63.5,99.06
  pour Bottom (isolate 0.406): 53.34,89.92 53.34,99.06 63.5,99.06 63.5,89.92
+3V3  (via drill 0.35)
  Top 0.305: v25.27,84.89 25.4,84.76 R11.2 | v41.78,85.01 41.82,85.06 U4.1 | v25.27,84.89 25.27,83.49 26.04,82.73 R12.2 | U3.1 25.31,84.93 v25.27,84.89
  Top 0.559: C1.1 79.38,19.85 U1.1 79.38,23.5 81.03,25.15 84.61,25.15 85.11,25.65 85.11,34.01 83.82,35.31 82.3,35.31 81.95,35.65 C3.1 81.95,41.87 U2.2 | C9.1 59.05,19.85 U6.1 59.05,23.5 60.71,25.15 64.29,25.15 64.8,25.65 64.8,34.01 63.5,35.31 61.98,35.31 61.63,35.65 C11.1 61.63,41.87 U5.2 | TP9.1 v41.4,98.09 v24.89,98.09 TP1.1 12.04,97.94 11.83,97.94 9.55,95.66 9.55,77.87 | C16.1 38.73,19.85 U10.1 38.73,23.5 40.39,25.15 43.97,25.15 44.48,25.65 44.48,34.01 43.18,35.31 41.66,35.31 41.31,35.65 C18.1 41.31,41.87 U9.2 | C24.1 18.41,19.85 U14.1 18.41,23.5 20.07,25.15 23.65,25.15 24.16,25.65 24.16,34.01 22.86,35.31 21.34,35.31 20.99,35.65 C26.1 20.99,41.87 U13.2 | 43.03,55.06 C23.1 | C23.1 39.97,55.16 U12.24 | C23.1 45.62,55.16 C28.1 45.53,54.99 TP71.1 v47.5,55.88 | U7.3 58.43,67.32 57.15,66.04 57.15,59.94 56.64,59.44 R26.2 55.88,59.42 TP28.1 53.85,55.88 v50.29,55.88 | 9.55,77.87 11.73,75.69 v47.75,75.69 | v50.29,75.69 56.39,75.69 59.94,72.14 | 9.55,77.87 3.71,77.87 1.02,75.18 1.02,49.28 4.06,46.23 J20.3V3
  Bottom 0.305: v25.27,84.89 25.27,90.8 25.97,91.5 25.97,92.5 25.27,93.21 25.22,93.21 24.83,93.6 24.83,95.48 24.89,95.54 v24.89,98.09 | v41.4,98.09 41.4,95.54 41.34,95.48 41.34,93.6 41.73,93.21 41.77,93.21 42.48,92.5 42.48,91.5 41.78,90.8 v41.78,85.01
  Bottom 0.559: U2.2 79.88,43.94 77.98,43.94 76.83,45.09 J2.3V3 66.77,46.23 64.69,44.14 63.66,44.14 62.61,43.09 62.61,42.93 U5.2 59.56,43.94 57.66,43.94 56.52,45.09 J8.3V3 46.45,46.23 44.37,44.14 43.34,44.14 42.29,43.09 42.29,42.93 U9.2 39.24,43.94 37.34,43.94 36.2,45.09 J14.3V3 26.13,46.23 24.05,44.14 23.02,44.14 21.97,43.09 21.97,42.93 U13.2 18.92,43.94 17.02,43.94 15.88,45.09 J20.3V3 | v47.75,75.69 v50.29,75.69 | v47.5,55.88 v50.29,55.88
  pour Top (isolate 0.305): 63.5,72.39 59.69,72.39 59.69,66.8 63.5,66.8
+5V  (via drill 0.35)
  Top 0.305: v37.41,85.14 37.42,85.15 U4.10 | R17.2 32.27,87.95 32,87.68 v32,85.65 32,83.62 32.27,83.35 R15.1 | v20.95,85.14 20.91,85.18 U3.10 | R8.2 15.51,87.95 15.24,87.68 v15.24,85.65 15.24,83.62 15.51,83.35 R7.1
  Top 0.559: TP10.1 v38.73,97.08 v22.23,97.08 TP2.1 10.41,95.3 10.41,78.23 11.94,76.71 v43.43,76.71 | 60.29,57.75 C14.1 | TP29.1 62.74,61.72 | v50.29,76.71 60.45,76.71 65.02,72.14 | R25.1 v43.43,73.91
  Bottom 0.305: v32,85.65 32.51,85.14 v37.41,85.14 37.41,92.78 38.73,94.1 v38.73,97.08 | v22.23,97.08 22.16,97.02 22.16,94.04 20.95,92.83 v20.95,85.14 15.75,85.14 v15.24,85.65
  Bottom 0.559: v50.29,76.71 v43.43,76.71 v43.43,73.91
  pour Top (isolate 0.305): 64.77,72.39 78.74,72.39 78.74,66.04 64.77,66.04
  pour Top (isolate 0.305): 63.5,57.15 63.5,62.99 59.69,62.99 59.69,57.15
  pour Top (isolate 0.406): 62.23,63.5 63.5,63.5 64.77,64.77 64.77,67.31 67.31,67.31 67.31,66.04 67.31,63.5 63.5,59.69 62.23,59.69
+24V  (via drill 0.35)
  Top 0.305: 19.68,95.94 19.56,96.06 | 27.62,96.06 27.62,92.63 25.89,90.9 R13.2 | TP17.1 85.6,79.5 86.87,78.23
  Top 0.559: TP4.1 13.97,96.06 v15.62,96.06 19.56,96.06 27.62,96.06 v36.2,96.06 45.72,96.06 TP11.1 50.8,90.98 50.8,88.65 | R21.2 67.82,95.25 66.55,93.98 66.55,87.88
  Bottom 0.305: J10.24V(6) v36.2,96.06
  Bottom 0.559: v15.62,96.06 15.62,91.63 16.59,90.67 17.7,90.67 19.03,92 J6.24V(6)
  Bottom 1.27: SJ1.1 84.84,62.48 86.36,60.96 v86.36,58.42
  other vias: 60.96,83.82 59.69,83.82 58.42,83.82 57.15,83.82 55.88,83.82 55.88,82.55 55.88,81.28 57.15,81.28 57.15,82.55 58.42,82.55 59.69,82.55 60.96,82.55 60.96,81.28 59.69,81.28 58.42,81.28 77.47,83.82 78.74,83.82 80.01,83.82 81.28,83.82 82.55,83.82 82.55,82.55 82.55,81.28 81.28,81.28 81.28,82.55 80.01,82.55 80.01,81.28 78.74,81.28 78.74,82.55 77.47,82.55 77.47,81.28
  pour Top (isolate 0.406): 50.8,78.74 50.8,88.9 88.9,88.9 88.9,78.74 76.2,78.74 76.2,82.55 62.23,82.55 62.23,78.74
  pour Bottom (isolate 0.406): 50.8,78.74 62.23,78.74 62.23,82.55 76.2,82.55 76.2,78.74 88.9,78.74 88.9,88.9 50.8,88.9
  pour Top (isolate 0.406): 85.09,72.39 88.9,72.39 88.9,57.15 85.09,57.15
  pour Top (isolate 0.406): 88.9,80.01 85.09,80.01 85.09,71.12 88.9,71.12
DSCLM_1
  Top 0.305: 18.03,88.19 R10.1 18.07,88.05 18.19,88.17 U3.6 20.91,94.5 J6.DSCLM(5) | 18.03,88.19 18.03,89.44 R9.2 | 18.05,88.17 18.03,88.19
DSCLM_2
  Top 0.305: R16.2 34.54,89.44 R18.1 34.77,88.17 U4.6 37.42,94.5 J10.DSCLM(5)
DSCLP_1
  Top 0.305: R8.1 R10.2 19.31,87.67 U3.7 22.09,87.67 22.23,87.81 J6.DSCLP(4)
DSCLP_2
  Top 0.305: R17.1 R18.2 34.54,86.41 35.81,87.67 U4.7 38.35,87.67 38.73,88.06 J10.DSCLP(4)
DSDAM_1
  Top 0.305: R4.2 19.56,83.35 | 19.56,83.35 20.03,83.35 R3.1 | 19.56,83.35 19.56,86.16 20.07,86.67 U3.9 22.6,86.67 24.13,88.2 24.13,91.36 J6.DSDAM(2)
DSDAM_2
  Top 0.305: R14.1 36.07,83.36 | 36.07,83.36 36.07,86.41 36.33,86.67 U4.9 39.11,86.67 | 36.07,83.36 34.56,83.36 R19.2 | 39.11,86.67 39.12,86.67 | 39.11,86.67 40.64,88.2 40.64,91.36 J10.DSDAM(2)
DSDAP_1
  Top 0.305: R4.1 R7.2 | 18.03,84.97 R4.1 | R4.1 18.56,84.9 18.89,85.24 18.89,86.25 19.81,87.17 U3.8 22.35,87.17 23.43,88.25 23.43,92.57 25.4,94.54 J6.DSDAP(1)
DSDAP_3
  Top 0.305: R15.2 R19.1 35.07,84.9 35.56,85.39 35.56,86.67 36.07,87.17 U4.8 38.61,87.17 39.94,88.51 39.94,92.37 40.77,93.21 41.21,93.21 J10.DSDAP(1)
GND  (via drill 0.35)
  Top 0.305: U3.5 26.65,88.17 | 26.65,88.17 26.67,88.19 | 26.65,88.17 27.16,88.17 v27.43,88.44 | U4.5 42.91,88.17 43.18,88.44 v43.18,89.2
  Bottom 0.406: J6.GND(3) 23.5,90.09 23.37,89.97
  other vias: 73.91,36.83 84.84,37.59 85.09,19.3 76.2,18.29 74.68,30.73 74.93,7.87 86.61,6.86 77.72,11.43 87.88,40.39 73.41,44.45 53.59,36.83 67.31,47.24 64.52,37.59 64.77,19.3 55.88,18.29 54.36,30.73 54.61,7.87 66.29,6.86 57.4,11.43 67.56,40.39 53.09,44.45 21.59,102.92 18.03,81.58 29.97,102.92 38.1,102.16 29.72,92.76 46.48,102.92 38.61,84.89 15.24,88.95 45.21,83.11 42.67,81.84 24.64,82.35 16.76,95.05 32.77,93.52 23.11,99.11 14.73,94.03 36.07,89.46 46.23,93.27 33.27,36.83 46.99,47.24 44.2,37.59 44.45,19.3 35.56,18.29 34.04,30.73 34.29,7.87 45.97,6.86 37.08,11.43 47.24,40.39 32.77,44.45 12.95,36.83 26.67,47.24 23.88,37.59 24.13,19.3 15.24,18.29 13.72,30.73 13.97,7.87 25.65,6.86 16.76,11.43 26.92,40.39 12.45,44.45 76.2,102.87 77.47,102.87 78.74,102.87 80.01,102.87 81.28,102.87 81.28,101.6 81.28,100.33 80.01,100.33 78.74,100.33 77.47,100.33 76.2,100.33 76.2,101.6 77.47,101.6 78.74,101.6 80.01,101.6 58.42,100.33 58.42,101.6 58.42,102.87 59.69,102.87 60.96,102.87 62.23,102.87 63.5,102.87 63.5,101.6 63.5,100.33 62.23,100.33 60.96,100.33 59.69,100.33 59.69,101.6 60.96,101.6 62.23,101.6 41.66,57.28 18.29,64.14 73.15,69.34 82.04,68.07 79.25,58.93 72.14,64.01 71.37,64.01 71.37,63.25 72.14,63.25 70.61,64.01 70.61,63.25 82.04,70.36 53.85,62.48 54.61,62.48 53.85,61.72 54.61,61.72 54.61,60.96 53.85,60.96 53.09,62.48 53.09,60.96 53.09,61.72 54.61,67.31 54.61,68.07 54.61,68.83 53.85,67.31 53.09,67.31 53.85,68.07 53.09,68.07 53.09,68.83 53.85,68.83 58.42,64.52 57.15,70.61 58.42,65.53 57.15,58.67
  pour Top (isolate 0.305, rank 3): 100.33,0 100.33,110.49 0,110.49 0,0
  pour Bottom (isolate 0.305, rank 3): 100.33,0 100.33,110.49 0,110.49 0,0
  pour Bottom (isolate 0.305, rank 2): 90.17,49.53 90.17,0 71.12,0 71.12,49.53
  pour Top (isolate 0.305, rank 2): 90.17,0 71.12,0 71.12,49.53 90.17,49.53
  pour Bottom (isolate 0.305, rank 2): 69.85,49.53 69.85,0 50.8,0 50.8,49.53
  pour Top (isolate 0.305, rank 2): 69.85,0 50.8,0 50.8,49.53 69.85,49.53
  pour Top (isolate 0.305): 11.43,114.3 11.43,78.74 48.26,78.74 48.26,114.3
  pour Bottom (isolate 0.406): 11.43,78.74 48.26,78.74 48.26,114.3 11.43,114.3
  pour Top (isolate 0.305, rank 3): 50.8,78.74 50.8,114.3 88.9,114.3 88.9,78.74
  pour Bottom (isolate 0.406, rank 3): 50.8,114.3 88.9,114.3 88.9,78.74 50.8,78.74
  pour Bottom (isolate 0.305, rank 2): 49.53,49.53 49.53,0 30.48,0 30.48,49.53
  pour Top (isolate 0.305, rank 2): 49.53,0 30.48,0 30.48,49.53 49.53,49.53
  pour Bottom (isolate 0.305, rank 2): 29.21,49.53 29.21,0 10.16,0 10.16,49.53
  pour Top (isolate 0.305, rank 2): 29.21,0 10.16,0 10.16,49.53 29.21,49.53
  pour Top (isolate 0.305): 48.26,76.2 1.27,76.2 1.27,52.07 48.26,52.07
  pour Bottom (isolate 0.305): 48.26,76.2 48.26,52.07 1.27,52.07 1.27,76.2
  pour Top (isolate 0.305, rank 2): 64.77,72.39 88.9,72.39 88.9,57.15 64.77,57.15
  pour Bottom (isolate 0.406, rank 2): 64.77,57.15 88.9,57.15 88.9,72.39 64.77,72.39
  pour Top (isolate 0.406, rank 3): 50.8,57.15 63.5,57.15 63.5,72.39 50.8,72.39
  pour Bottom (isolate 0.406): 50.8,57.15 50.8,72.39 63.5,72.39 63.5,57.15
ISO_3V3_1  (via drill 0.35)
  Top 0.559: R1.2 79.38,28.81 U1.8 79.38,24.72 78.19,23.53 C2.1 | J3.4 78.11,18.41 77.47,19.3 C2.1 | C2.1 76.8,23.53 76.37,23.96 v76.37,28.96 C4.1 76.37,41.44 U2.4 | R2.2 83.07,28.96 v84.23,28.96
  Bottom 0.559: v84.23,28.96 v76.37,28.96
ISO_3V3_2  (via drill 0.35)
  Top 0.559: R6.2 59.05,28.81 U6.8 59.05,24.72 57.87,23.53 C10.1 | J7.4 57.78,18.41 57.15,19.3 C10.1 | C10.1 56.48,23.53 56.05,23.96 v56.05,28.96 C12.1 56.05,41.44 U5.4 | R5.2 62.75,28.96 v63.91,28.96
  Bottom 0.559: v63.91,28.96 v56.05,28.96
ISO_3V3_3  (via drill 0.35)
  Top 0.559: R24.2 38.73,28.81 U10.8 38.73,24.72 37.55,23.53 C17.1 | J13.4 37.47,18.41 36.83,19.3 C17.1 | C17.1 36.16,23.53 35.73,23.96 v35.73,28.96 C19.1 35.73,41.44 U9.4 | R23.2 42.43,28.96 v43.59,28.96
  Bottom 0.559: v43.59,28.96 v35.73,28.96
ISO_3V3_4  (via drill 0.35)
  Top 0.559: R28.2 18.41,28.81 U14.8 18.41,24.72 17.23,23.53 C25.1 | J19.4 17.14,18.41 16.51,19.3 C25.1 | C25.1 15.84,23.53 15.41,23.96 v15.41,28.96 C27.1 15.41,41.44 U13.4 | R27.2 22.11,28.96 v23.27,28.96
  Bottom 0.559: v23.27,28.96 v15.41,28.96
ISO_GND_1  (via drill 0.35)
  Top 0.559: C2.2 v77.47,26.92 77.47,31.5 78.11,32.13 J3.3 78.11,36.54 C4.2 78.07,38.95 79.38,40.26 U2.3 | v84.23,26.92 83.26,26.92 U1.5
  Bottom 0.559: v84.23,26.92 v77.47,26.92
ISO_GND_2  (via drill 0.35)
  Top 0.559: C10.2 v57.15,26.92 57.15,31.5 57.78,32.13 J7.3 57.78,36.54 C12.2 57.75,38.95 59.05,40.26 U5.3 | v63.91,26.92 62.94,26.92 U6.5
  Bottom 0.559: v63.91,26.92 v57.15,26.92
ISO_GND_3  (via drill 0.35)
  Top 0.559: C17.2 v36.83,26.92 36.83,31.5 37.47,32.13 J13.3 37.47,36.54 C19.2 37.43,38.95 38.73,40.26 U9.3 | v43.59,26.92 42.62,26.92 U10.5
  Bottom 0.559: v43.59,26.92 v36.83,26.92
ISO_GND_4  (via drill 0.35)
  Top 0.559: C25.2 v16.51,26.92 16.51,31.5 17.14,32.13 J19.3 17.14,36.54 C27.2 17.11,38.95 18.41,40.26 U13.3 | v23.27,26.92 22.3,26.92 U14.5
  Bottom 0.559: v23.27,26.92 v16.51,26.92
ISO_SCL_1
  Top 0.305: 81.92,30.48 81.92,31.75 J3.1 | R2.1 83.04,30.48 81.92,30.48 | 81.92,30.48 U1.6
ISO_SCL_2
  Top 0.305: 61.59,30.48 61.59,31.75 J7.1 | R5.1 62.72,30.48 61.59,30.48 | 61.59,30.48 U6.6
ISO_SCL_3
  Top 0.305: 41.27,30.48 41.27,31.75 J13.1 | R23.1 42.4,30.48 41.27,30.48 | 41.27,30.48 U10.6
ISO_SCL_4
  Top 0.305: 20.95,30.48 20.95,31.75 J19.1 | R27.1 22.08,30.48 20.95,30.48 | 20.95,30.48 U14.6
ISO_SDA_1
  Top 0.305: 80.64,30.48 J3.2 | R1.1 80.63,30.5 80.64,30.48 | 80.64,30.48 U1.7
ISO_SDA_2
  Top 0.305: 60.33,30.48 J7.2 | R6.1 60.31,30.5 60.33,30.48 | 60.33,30.48 U6.7
ISO_SDA_3
  Top 0.305: 40.01,30.48 J13.2 | R24.1 39.99,30.5 40.01,30.48 | 40.01,30.48 U10.7
ISO_SDA_4
  Top 0.305: 19.68,30.48 J19.2 | R28.1 19.67,30.5 19.68,30.48 | 19.68,30.48 U14.7
N$4
  Top 0.559: 40.01,72.9 U12.1 41.67,71.23 R25.2
N$5
  Top 0.305: R13.1 D1.A
N$6
  Top 0.559: D2.A 70.6,95.28 R21.1
N$8
  Top 0.559: R22.1 80.49,68.31 D4.A
N$11
  Top 0.305: D6.A 56.41,68.31 56.41,61.38 54.47,59.44 R26.1
PGND_1
  Top 0.559: J3.6 J1.GND
PGND_2
  Top 0.559: J7.6 J9.GND
PGND_3
  Top 0.559: J13.6 J15.GND
PGND_4
  Top 0.559: J19.6 J21.GND
PRB_1
  Top 0.559: J1.S J3.5
PRB_2
  Top 0.559: J9.S J7.5
PRB_3
  Top 0.559: J15.S J13.5
PRB_4
  Top 0.559: J21.S J19.5
SCL  (via drill 0.35)
  Top 0.305: U1.3 81.92,23.24 82.3,23.62 85.6,23.62 86.46,24.49 86.46,43.29 85.84,43.92 84.23,43.92 J2.SCL 81.83,46.31 81.83,47.3 77.47,51.66 61.59,51.66 | J8.SCL 63.91,43.92 65.52,43.92 66.14,43.29 66.14,24.49 65.28,23.62 61.98,23.62 61.59,23.24 U6.3 | U10.3 41.27,23.24 41.66,23.62 44.96,23.62 45.82,24.49 45.82,43.29 45.2,43.92 43.59,43.92 J14.SCL 36.85,50.65 20.95,50.65 | J20.SCL 23.27,43.92 24.88,43.92 25.5,43.29 25.5,24.49 24.64,23.62 21.34,23.62 20.95,23.24 U14.3 | TP6.1 22.86,86.06 24.48,87.67 U3.4 29.73,87.67 29.85,87.55 | 31.5,83.11 31.24,83.36 31.24,86.16 29.85,87.55 | 29.85,87.55 29.85,88.18 v29.84,88.19 | v29.84,83.43 29.15,82.73 R12.1 | 31.5,83.11 | 31.5,83.11 32.26,82.35 38.86,82.35 39.62,83.11 39.62,86.31 40.99,87.67 U4.4 47.25,87.67 TP13.1 47.5,87.34 49.38,85.46 49.38,59.44 | 49.38,59.44 49.38,53.24 50.95,51.66 61.59,51.66 | v61.59,52.58 61.59,51.66 | TP58.1 v46.48,59.44 18.67,59.44 U12.14 19.07,50.65 20.95,50.65 | v50.29,59.44 49.38,59.44 | v20.95,51.44 20.95,50.65
  Bottom 0.305: v29.84,88.19 v29.84,83.43 | J8.SCL v61.59,52.58 | v46.48,59.44 v50.29,59.44 | J20.SCL v20.95,51.44
SDA
  Top 0.305: U1.2 80.64,23.24 81.79,24.38 85.5,24.38 85.85,24.74 85.85,43.04 85.58,43.31 82.3,43.31 J2.SDA 79.38,48.9 77.22,51.05 59.18,51.05 | U6.2 60.33,23.24 61.47,24.38 65.18,24.38 65.53,24.74 65.53,43.04 65.26,43.31 61.98,43.31 J8.SDA 59.18,46.23 59.18,51.05 | U10.2 40.01,23.24 41.15,24.38 44.86,24.38 45.21,24.74 45.21,43.04 44.94,43.31 41.66,43.31 J14.SDA 34.92,50.04 18.54,50.04 | U14.2 19.68,23.24 20.83,24.38 24.54,24.38 24.89,24.74 24.89,43.04 24.62,43.31 21.34,43.31 J20.SDA 18.54,46.23 18.54,50.04 | TP5.1 23.62,85.9 24.39,86.67 U3.2 28.19,86.67 | 28.19,86.67 29.86,86.67 30.63,85.9 30.63,83.11 32.01,81.74 39.12,81.74 40.23,82.86 40.23,86.06 40.85,86.67 U4.2 47.24,86.67 TP14.1 48.77,85.14 48.77,60.2 | R11.1 28.21,86.66 28.19,86.67 | 48.77,60.2 48.77,52.99 50.7,51.05 59.18,51.05 | 48.77,60.2 TP73.1 16.89,60.2 U12.13 17.14,50.04 18.54,50.04
USBM
  Top 0.305: TP8.1 14.48,89.33 J6.USBM(8)
  Bottom 0.305: J10.USBM(8) 32.06,92 23.94,100.12 21.84,100.12 20.44,98.73 20.44,95.75 19.75,95.05 19.75,94.16 17.58,92 J6.USBM(8)
USBP
  Top 0.305: TP7.1 13.72,90.47 17.78,94.54 J6.USBP(7)
  Bottom 0.305: J6.USBP(7) 18.93,95.05 18.93,96.38 19.84,97.29 19.84,98.98 21.59,100.73 24.19,100.73 30.38,94.54 J10.USBP(7)

### Text on the board
tPlace: EDGE | EDGE | GND | GND | 3V3 | 3V3 | GND | GND | 5V | 5V | 24V | 24V | NC | SCL | SDA | USBP | Description: Connects x4 Atlas probes / to the nervous system board via / RJ45-dI2C comms. Includes photon / headers for optional standalone control. | SCL | 24V | GND | 24V | USBM | SDA | NC | RJ45 Connector Pair w/dI2C Buffer + LED | Barrel Jack Connector Pair w/24V Conditioning + Fuse + LED | Particle Photon | NC | 5V | GND | 5V Enable | 3.3V | GND | GND | GND | 24V | 5V | 3.3V | GND | GND | 5V to 3.3V@400mA / Linear Regulator w/ LED | 24V to 5V@1A Switching Regulator / w/Optional EMI Filter + Indicator LED | 3V3 | NC | Atlas Sensor Port w/Header | Atlas Sensor Port w/Header | Atlas Sensor Port w/Header | Atlas Sensor Port w/Header | Want to get involved? / - Chat with us: forum.openag.media.mit.edu / - Follow our twitter: @MITOpenAg / - Make a pull request: @OpenAgInitiative | NC | NC | NC | NC | NC | NC | NC | NC | EDGE | EDGE | EDGE | EDGE